# EAGLE design MegaGRRLDesktop (EAGLE 9.5.0)

## Sheet 1 of 7: Power supply
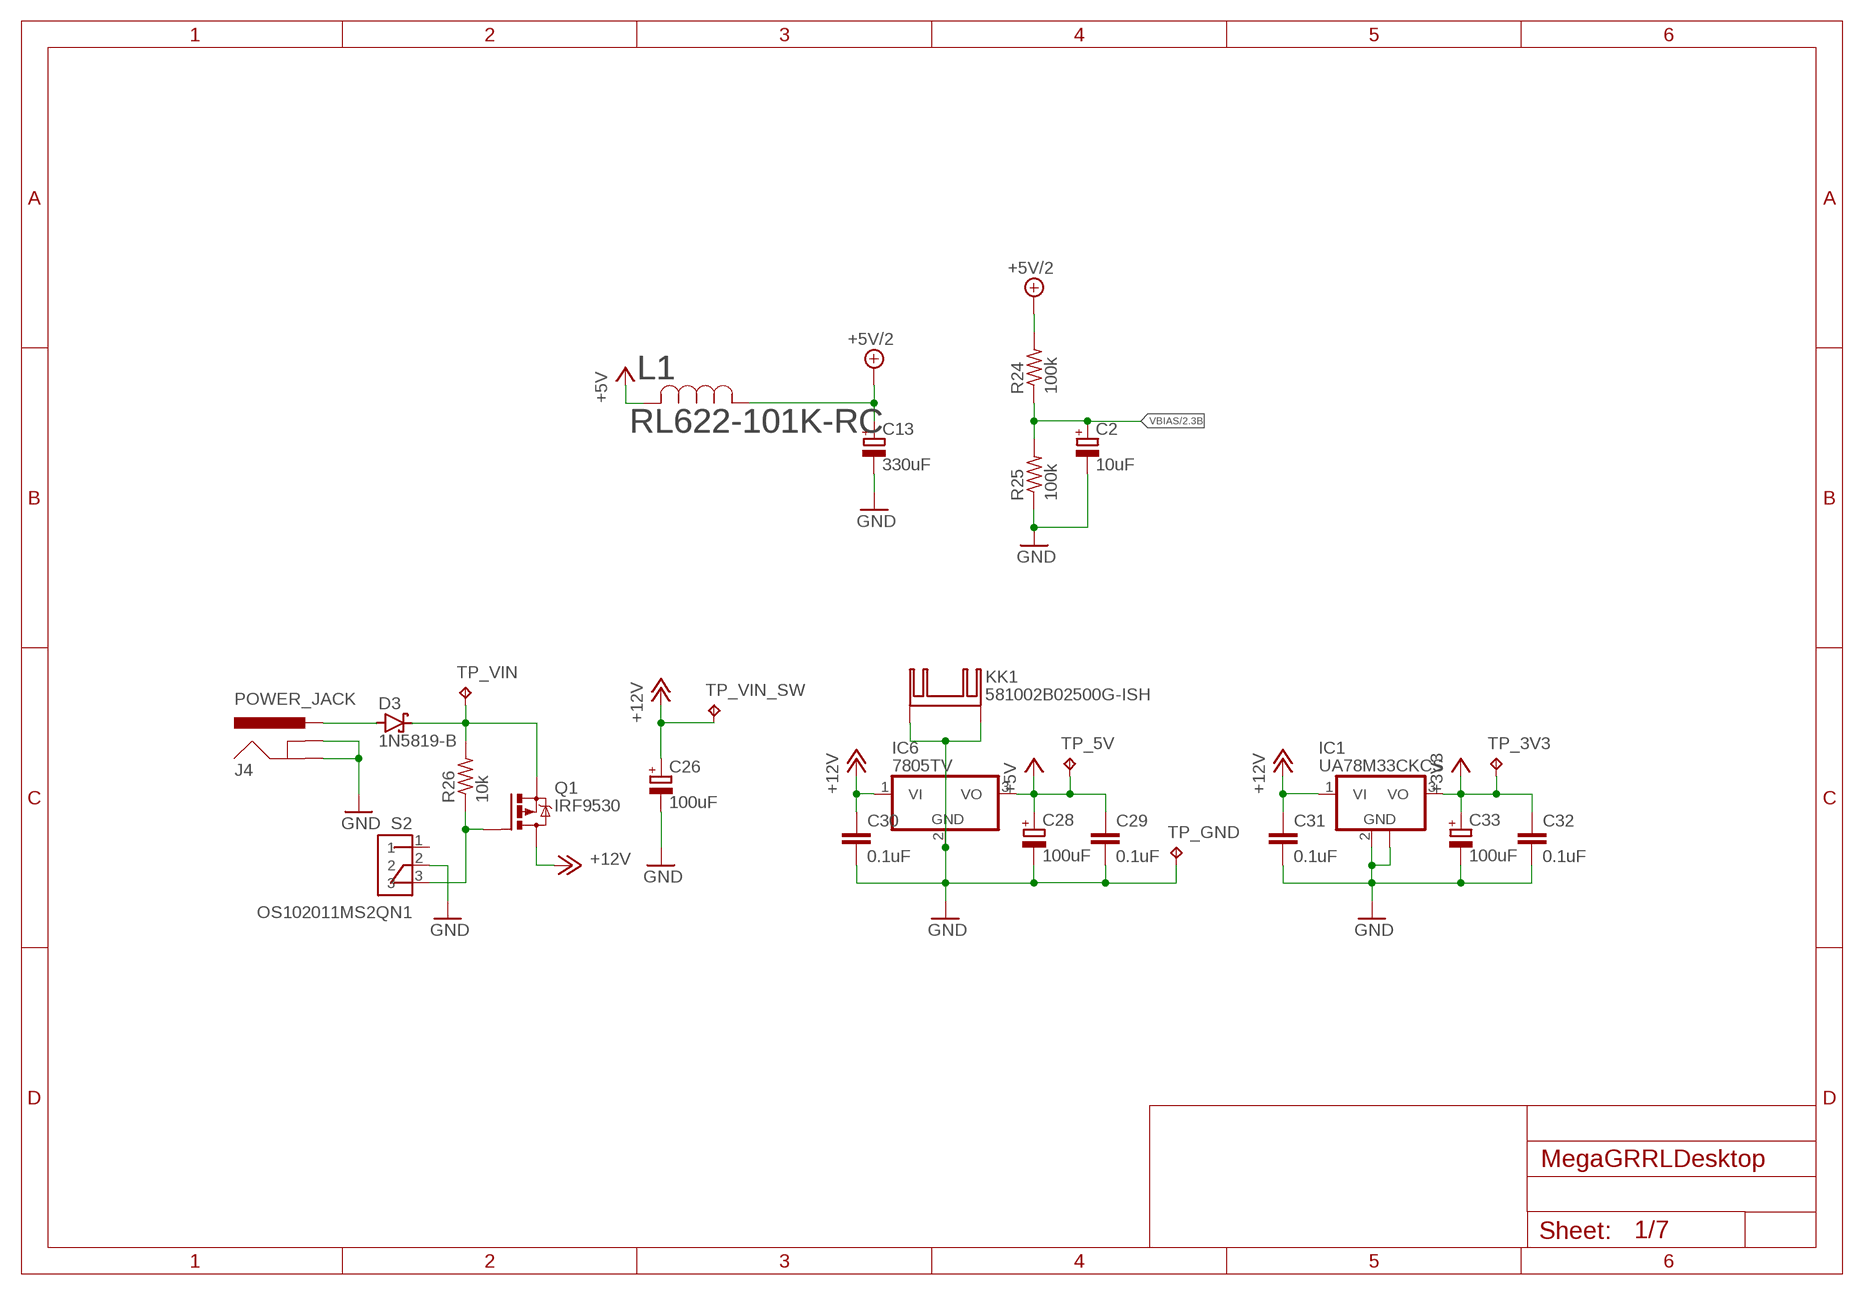
[diagram p0: schematic, sheet 1]

### Parts
C2  10uF  CPOL-EUE2.5-5  [E2,5-5]
C13  330uF  CPOL-EUE2.5-7  [E2,5-7]
C26  100uF  CPOL-EUE2.5-7  [E2,5-7]
C28  100uF  CPOL-EUE2.5-7  [E2,5-7]
C29  0.1uF  C-EU025-024X044  [C025-024X044]
C30  0.1uF  C-EU025-024X044  [C025-024X044]
C31  0.1uF  C-EU025-024X044  [C025-024X044]
C32  0.1uF  C-EU025-024X044  [C025-024X044]
C33  100uF  CPOL-EUE2.5-7  [E2,5-7]
D3  1N5819-B  [DO41-7.6]
IC1  UA78M33CKCS  UA78M33KCS  [TO220H]
IC6  7805TV  [TO220V]
J4  POWER_JACK  [POWER_JACK_PTH]
KK1  581002B02500G-ISH  [581002B02500G-ISH]
L1  RL622-101K-RC  [RL622_SERIES]
Q1  IRF9530  [TO220BV]
R24  100k  R-US_0204/7  [0204/7]
R25  100k  R-US_0204/7  [0204/7]
R26  10k  R-US_0204/7  [0204/7]
S2  OS102011MS2QN1  [SW_OS102011MS2QN1]
TP_3V3  TPB1,27  [B1,27]
TP_5V  TPB1,27  [B1,27]
TP_GND  TPB1,27  [B1,27]
TP_VIN  TPB1,27  [B1,27]
TP_VIN_SW  TPB1,27  [B1,27]

### Nets
+3V3: C32.1 C33.+ IC1.3(VO) TP_3V3.TP ; also sheet 3,4,5
+5V: C28.+ C29.1 IC6.3(VO) L1.2 TP_5V.TP ; also sheet 3,4,6
+5V/2: C13.+ L1.1 R24.2 ; also sheet 2,6
+12V: C26.+ C30.1 C31.1 IC1.1(VI) IC6.1(VI) Q1.D TP_VIN_SW.TP
GND: C2.- C13.- C26.- C28.- C29.2 C30.2 C31.2 C32.2 C33.- IC1.2(GND) IC1.TAB(GND) IC6.2(GND) J4.GND J4.GNDBREAK KK1.B1(K) KK1.B(K) R25.1 S2.2 TP_GND.TP ; also sheet 2,3,4,5,6
N$30: D3.C Q1.S R26.2 TP_VIN.TP
N$31: Q1.G R26.1 S2.3
N$32: D3.A J4.PWR
VBIAS: C2.+ R24.1 R25.2 ; also sheet 2
Unconnected: S2.1

## Sheet 2 of 7: Audio
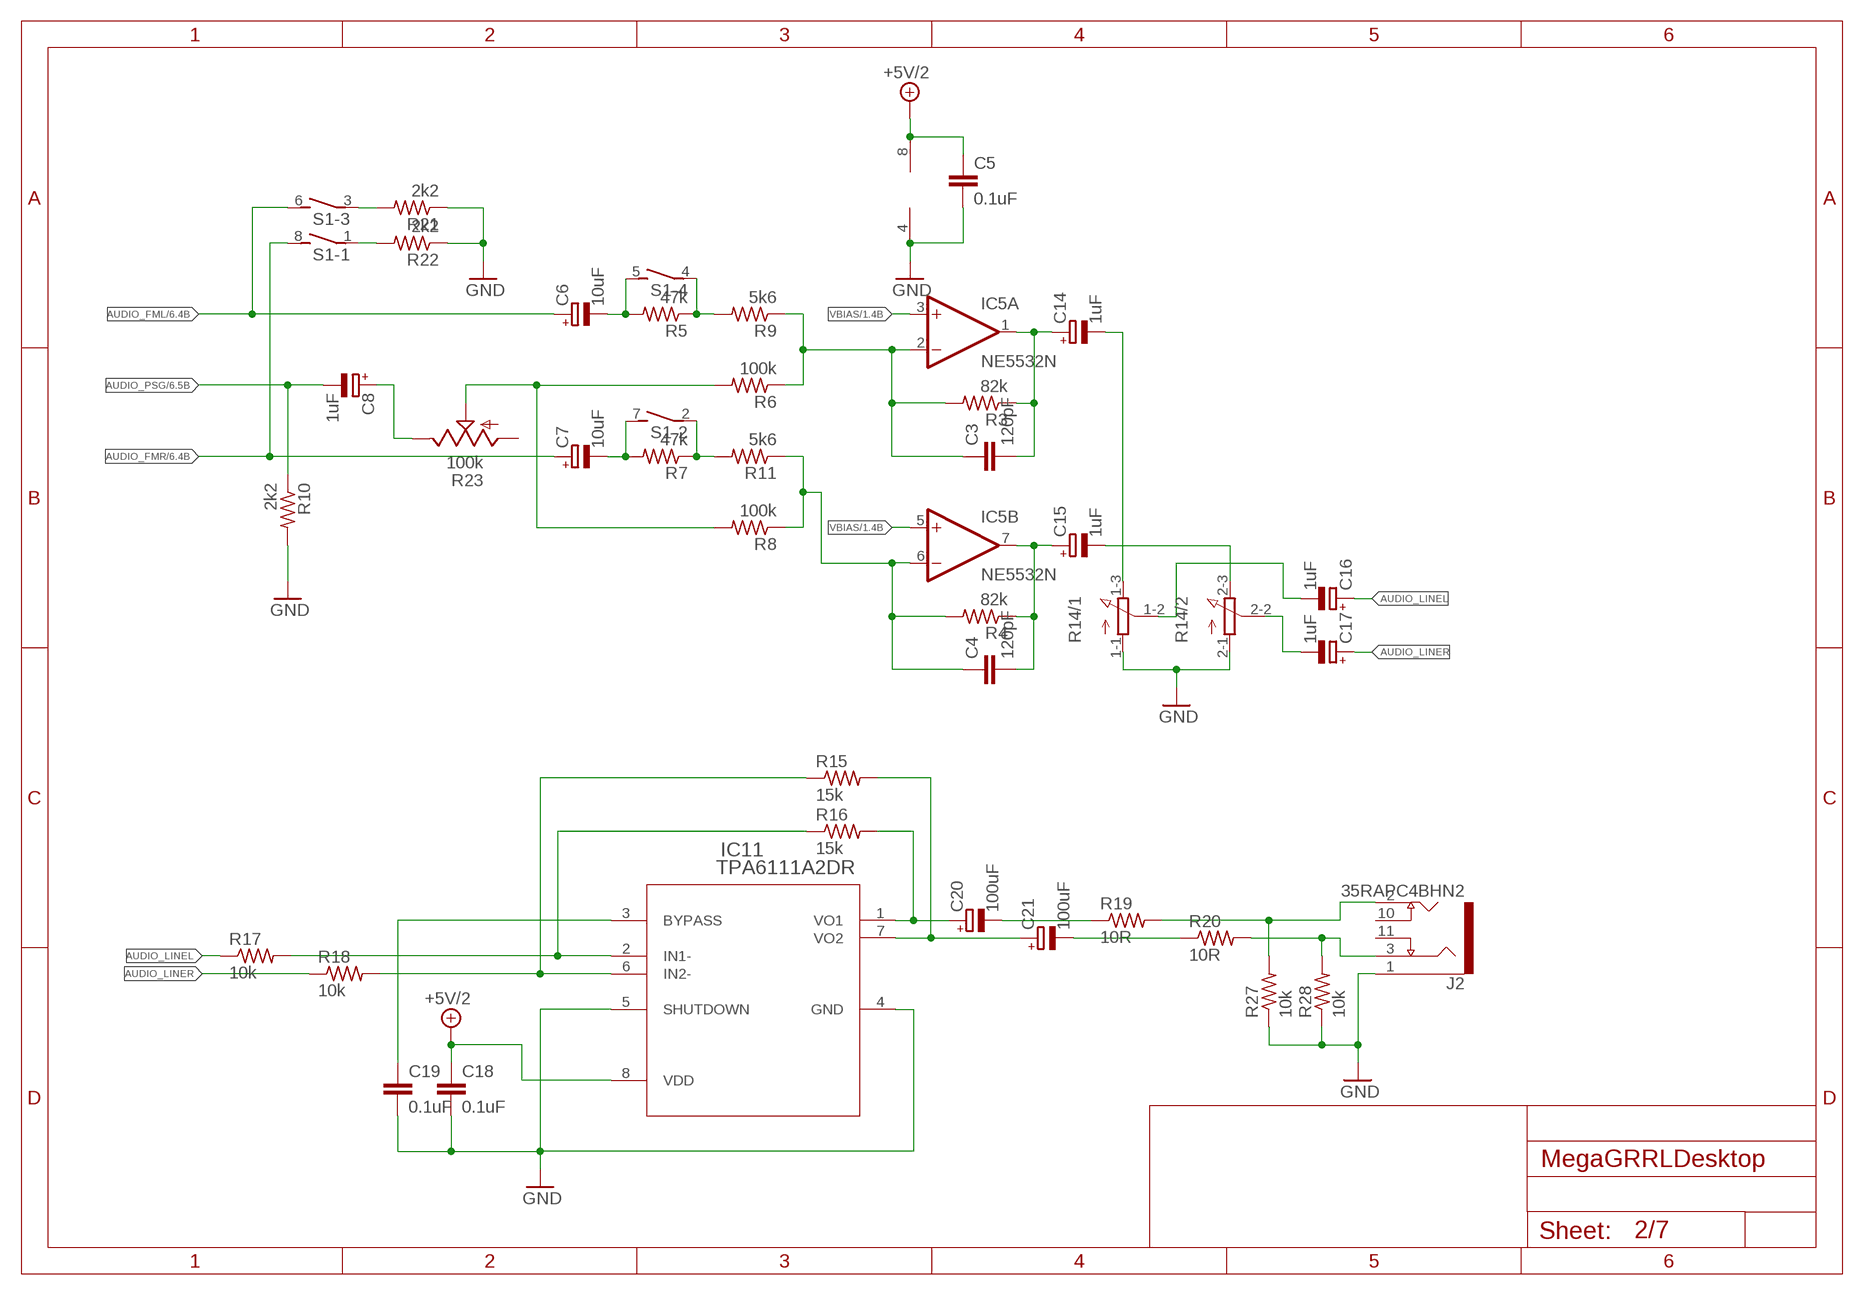
[diagram p1: schematic, sheet 2]

### Parts
C3  120pF  C-EU025-024X044  [C025-024X044]
C4  120pF  C-EU025-024X044  [C025-024X044]
C5  0.1uF  C-EU025-024X044  [C025-024X044]
C6  10uF  CPOL-EUE2.5-5  [E2,5-5]
C7  10uF  CPOL-EUE2.5-5  [E2,5-5]
C8  1uF  CPOL-EUE2-4  [E2-4]
C14  1uF  CPOL-EUE2-4  [E2-4]
C15  1uF  CPOL-EUE2-4  [E2-4]
C16  1uF  CPOL-EUE2-4  [E2-4]
C17  1uF  CPOL-EUE2-4  [E2-4]
C18  0.1uF  C-EU025-024X044  [C025-024X044]
C19  0.1uF  C-EU025-024X044  [C025-024X044]
C20  100uF  CPOL-EUE2.5-7  [E2,5-7]
C21  100uF  CPOL-EUE2.5-7  [E2,5-7]
IC5  NE5532N  [DIL08]
IC11  TPA6111A2DR  [D8]
J2  35RAPC4BHN2  [SWITCHCRAFT_35RAPC4BHN2]
R3  82k  R-US_0204/7  [0204/7]
R4  82k  R-US_0204/7  [0204/7]
R5  47k  R-US_0204/7  [0204/7]
R6  100k  R-US_0204/7  [0204/7]
R7  47k  R-US_0204/7  [0204/7]
R8  100k  R-US_0204/7  [0204/7]
R9  5k6  R-US_0204/7  [0204/7]
R10  2k2  R-US_0204/7  [0204/7]
R11  5k6  R-US_0204/7  [0204/7]
R14  3RP/1610G  [3RP/1610G]
R15  15k  R-US_0204/7  [0204/7]
R16  15k  R-US_0204/7  [0204/7]
R17  10k  R-US_0204/7  [0204/7]
R18  10k  R-US_0204/7  [0204/7]
R19  10R  R-US_0204/7  [0204/7]
R20  10R  R-US_0204/7  [0204/7]
R21  2k2  R-US_0204/7  [0204/7]
R22  2k2  R-US_0204/7  [0204/7]
R23  100k  TRIM_US-S64W  [S64W]
R27  10k  R-US_0204/7  [0204/7]
R28  10k  R-US_0204/7  [0204/7]
S1  DIP04S  [DIP04S]

### Nets
+5V/2: C5.1 C18.1 IC5.8(P:V+) IC11.8(VDD) ; also sheet 1,6
AUDIO_FML: C6.+ S1.6 ; also sheet 6
AUDIO_FMR: C7.+ S1.8 ; also sheet 6
AUDIO_LINEL: C16.+ R17.1
AUDIO_LINER: C17.+ R18.1
AUDIO_PSG: C8.- R10.1 ; also sheet 6
AUDIO_RAWL: C3.1 IC5.2(A:-IN) R3.2 R6.1 R9.1
AUDIO_RAWR: C4.1 IC5.6(B:-IN) R4.2 R8.1 R11.1
GND: C5.2 C18.2 C19.2 IC5.4(P:V-) IC11.4(GND) IC11.5(SHUTDOWN) J2.1(SLEEVE) R10.2 R14.1-1(/1:A) R14.2-1(/2:A) R21.1 R22.1 R27.1 R28.1 ; also sheet 1,3,4,5,6
N$3: R7.1 R11.2 S1.2
N$5: C3.2 C14.+ IC5.1(A:OUT) R3.1
N$7: C4.2 C15.+ IC5.7(B:OUT) R4.1
N$8: C14.- R14.1-3(/1:E)
N$9: R6.2 R8.2 R23.S
N$10: C7.- R7.2 S1.7
N$11: C6.- R5.2 S1.5
N$12: C15.- R14.2-3(/2:E)
N$13: C16.- R14.1-2(/1:S)
N$14: C17.- R14.2-2(/2:S)
N$15: IC11.2(IN1-) R16.1 R17.2
N$16: IC11.6(IN2-) R15.1 R18.2
N$17: C20.+ IC11.1(VO1) R16.2
N$18: C21.+ IC11.7(VO2) R15.2
N$19: C19.1 IC11.3(BYPASS)
N$20: J2.2(TIP) R19.2 R27.2
N$21: C20.- R19.1
N$22: C21.- R20.1
N$23: J2.3(RING) R20.2 R28.2
N$24: R5.1 R9.2 S1.4
N$25: R21.2 S1.3
N$26: R22.2 S1.1
N$27: C8.+ R23.E
VBIAS: IC5.3(A:+IN) IC5.5(B:+IN) ; also sheet 1
Unconnected: J2.10(TSH) J2.11(RSH) R23.A

## Sheet 3 of 7: MCU & interface
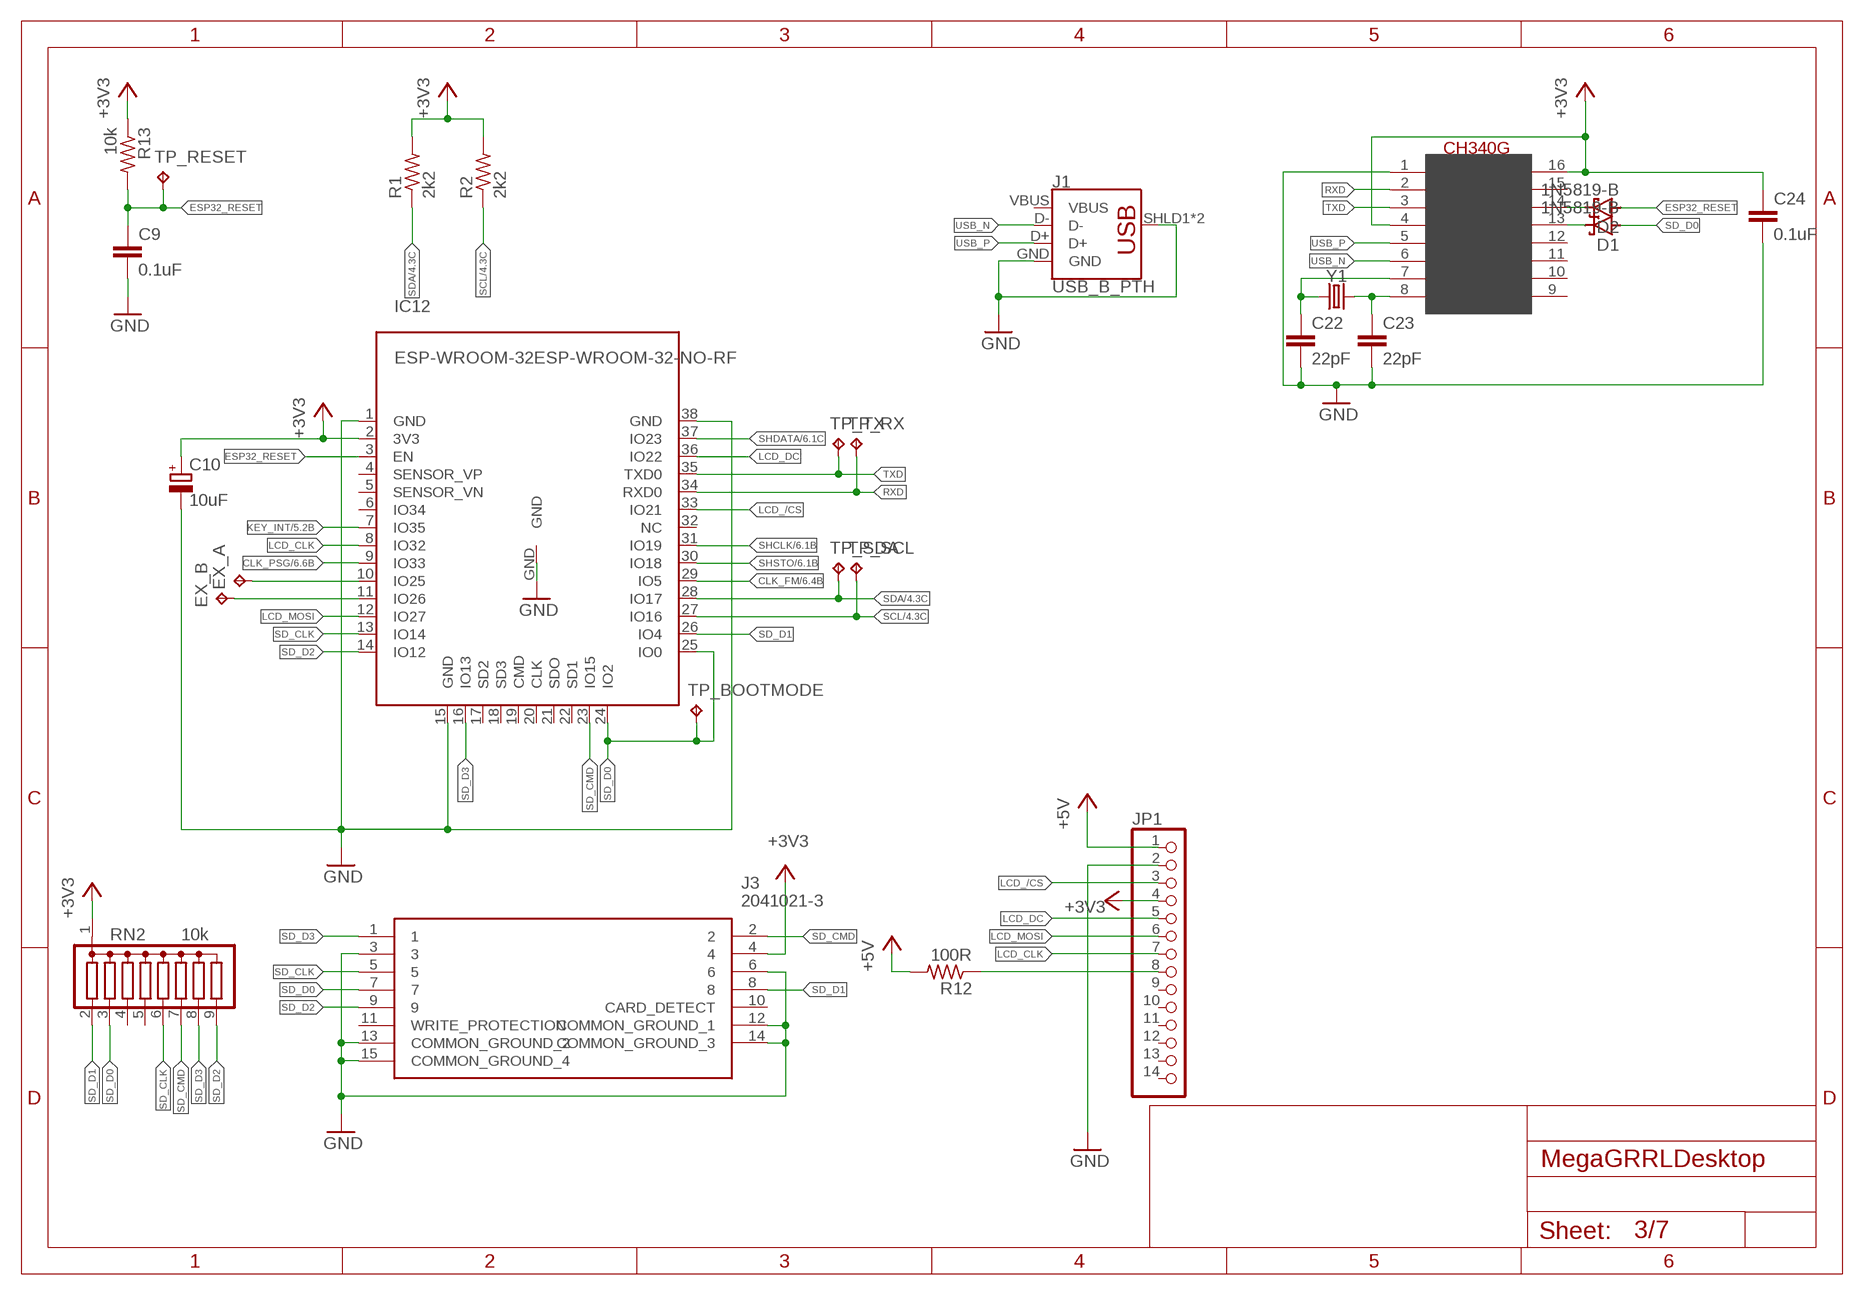
[diagram p2: schematic, sheet 3]

### Parts
C9  0.1uF  C-EU025-024X044  [C025-024X044]
C10  10uF  CPOL-EUE2.5-5  [E2,5-5]
C22  22pF  C-EU025-024X044  [C025-024X044]
C23  22pF  C-EU025-024X044  [C025-024X044]
C24  0.1uF  C-EU025-024X044  [C025-024X044]
D1  1N5819-B  [DO41-7.6]
D2  1N5819-B  [DO41-7.6]
EX_A  TPB1,27  [B1,27]
EX_B  TPB1,27  [B1,27]
IC12  ESP-WROOM-32ESP-WROOM-32-NO-RF  [ESP-WROOM-32-NO-RF]
IC14  CH340G  [SOIC16]
J1  USB_B_PTH  [USB-B-PTH]
J3  2041021-3  [2041021-3_2]
JP1  ILI9341_2_4  [ILI9341_2_4]
R1  2k2  R-US_0204/7  [0204/7]
R2  2k2  R-US_0204/7  [0204/7]
R12  100R  R-US_0204/7  [0204/7]
R13  10k  R-US_0204/7  [0204/7]
RN2  10k  G08R  [SIL9]
TP_BOOTMODE  TPB1,27  [B1,27]
TP_RESET  TPB1,27  [B1,27]
TP_RX  TPB1,27  [B1,27]
TP_SCL  TPB1,27  [B1,27]
TP_SDA  TPB1,27  [B1,27]
TP_TX  TPB1,27  [B1,27]
Y1  CRYSTALPTH-HC49US  [HC49US]

### Nets
+3V3: C10.+ C24.1 IC12.2(3V3) IC14.4(V3) IC14.16(VCC) J3.4 JP1.4 R1.2 R2.2 R13.1 RN2.1 ; also sheet 1,4,5
+5V: JP1.1 R12.2 ; also sheet 1,4,6
CLK_FM: IC12.29(IO5) ; also sheet 6
CLK_PSG: IC12.9(IO33) ; also sheet 6
ESP32_RESET: C9.1 D2.A IC12.3(EN) R13.2 TP_RESET.TP
GND: C9.2 C10.- C22.2 C23.2 C24.2 IC12.1(GND) IC12.15(GND) IC12.38(GND) IC12.GND IC14.1(GND) J1.GND J1.SHLD1(SHIELD) J1.SHLD2(SHIELD) J3.3 J3.6 J3.12(COMMON_GROUND_1) J3.13(COMMON_GROUND_2) J3.14(COMMON_GROUND_3) J3.15(COMMON_GROUND_4) JP1.2 ; also sheet 1,2,4,5,6
KEY_INT: IC12.7(IO35) ; also sheet 5
LCD_/CS: IC12.33(IO21) JP1.3
LCD_CLK: IC12.8(IO32) JP1.7
LCD_DC: IC12.36(IO22) JP1.5
LCD_MOSI: IC12.12(IO27) JP1.6
N$1: C23.1 IC14.8(XO) Y1.2
N$2: C22.1 IC14.7(XI) Y1.1
N$6: JP1.8 R12.1
N$28: D1.C IC14.13(DTR)
N$29: D2.C IC14.14(RTS)
N$33: EX_A.TP IC12.10(IO25)
N$34: EX_B.TP IC12.11(IO26)
RXD: IC12.34(RXD0) IC14.2(TX) TP_RX.TP
SCL: IC12.27(IO16) R2.1 TP_SCL.TP ; also sheet 4,5
SD_CLK: IC12.13(IO14) J3.5 RN2.6
SD_CMD: IC12.23(IO15) J3.2 RN2.7
SD_D0: D1.A IC12.24(IO2) IC12.25(IO0) J3.7 RN2.3 TP_BOOTMODE.TP
SD_D1: IC12.26(IO4) J3.8 RN2.2
SD_D2: IC12.14(IO12) J3.9 RN2.9
SD_D3: IC12.16(IO13) J3.1 RN2.8
SDA: IC12.28(IO17) R1.1 TP_SDA.TP ; also sheet 4,5
SHCLK: IC12.31(IO19) ; also sheet 6
SHDATA: IC12.37(IO23) ; also sheet 6
SHSTO: IC12.30(IO18) ; also sheet 6
TXD: IC12.35(TXD0) IC14.3(RX) TP_TX.TP
USB_N: IC14.6(D-) J1.D-
USB_P: IC14.5(D+) J1.D+
Unconnected: IC12.4(SENSOR_VP) IC12.5(SENSOR_VN) IC12.6(IO34) IC12.17(SD2) IC12.18(SD3) IC12.19(CMD) IC12.20(CLK) IC12.21(SDO) IC12.22(SD1) IC12.32(NC) IC14.9(CTS) IC14.10(DSR) IC14.11(RI) IC14.12(DCD) IC14.15(RS232) J3.10(CARD_DETECT) J3.11(WRITE_PROTECTION) JP1.9 JP1.10 JP1.11 JP1.12 JP1.13 JP1.14 RN2.4 RN2.5

## Sheet 4 of 7: LED drivers
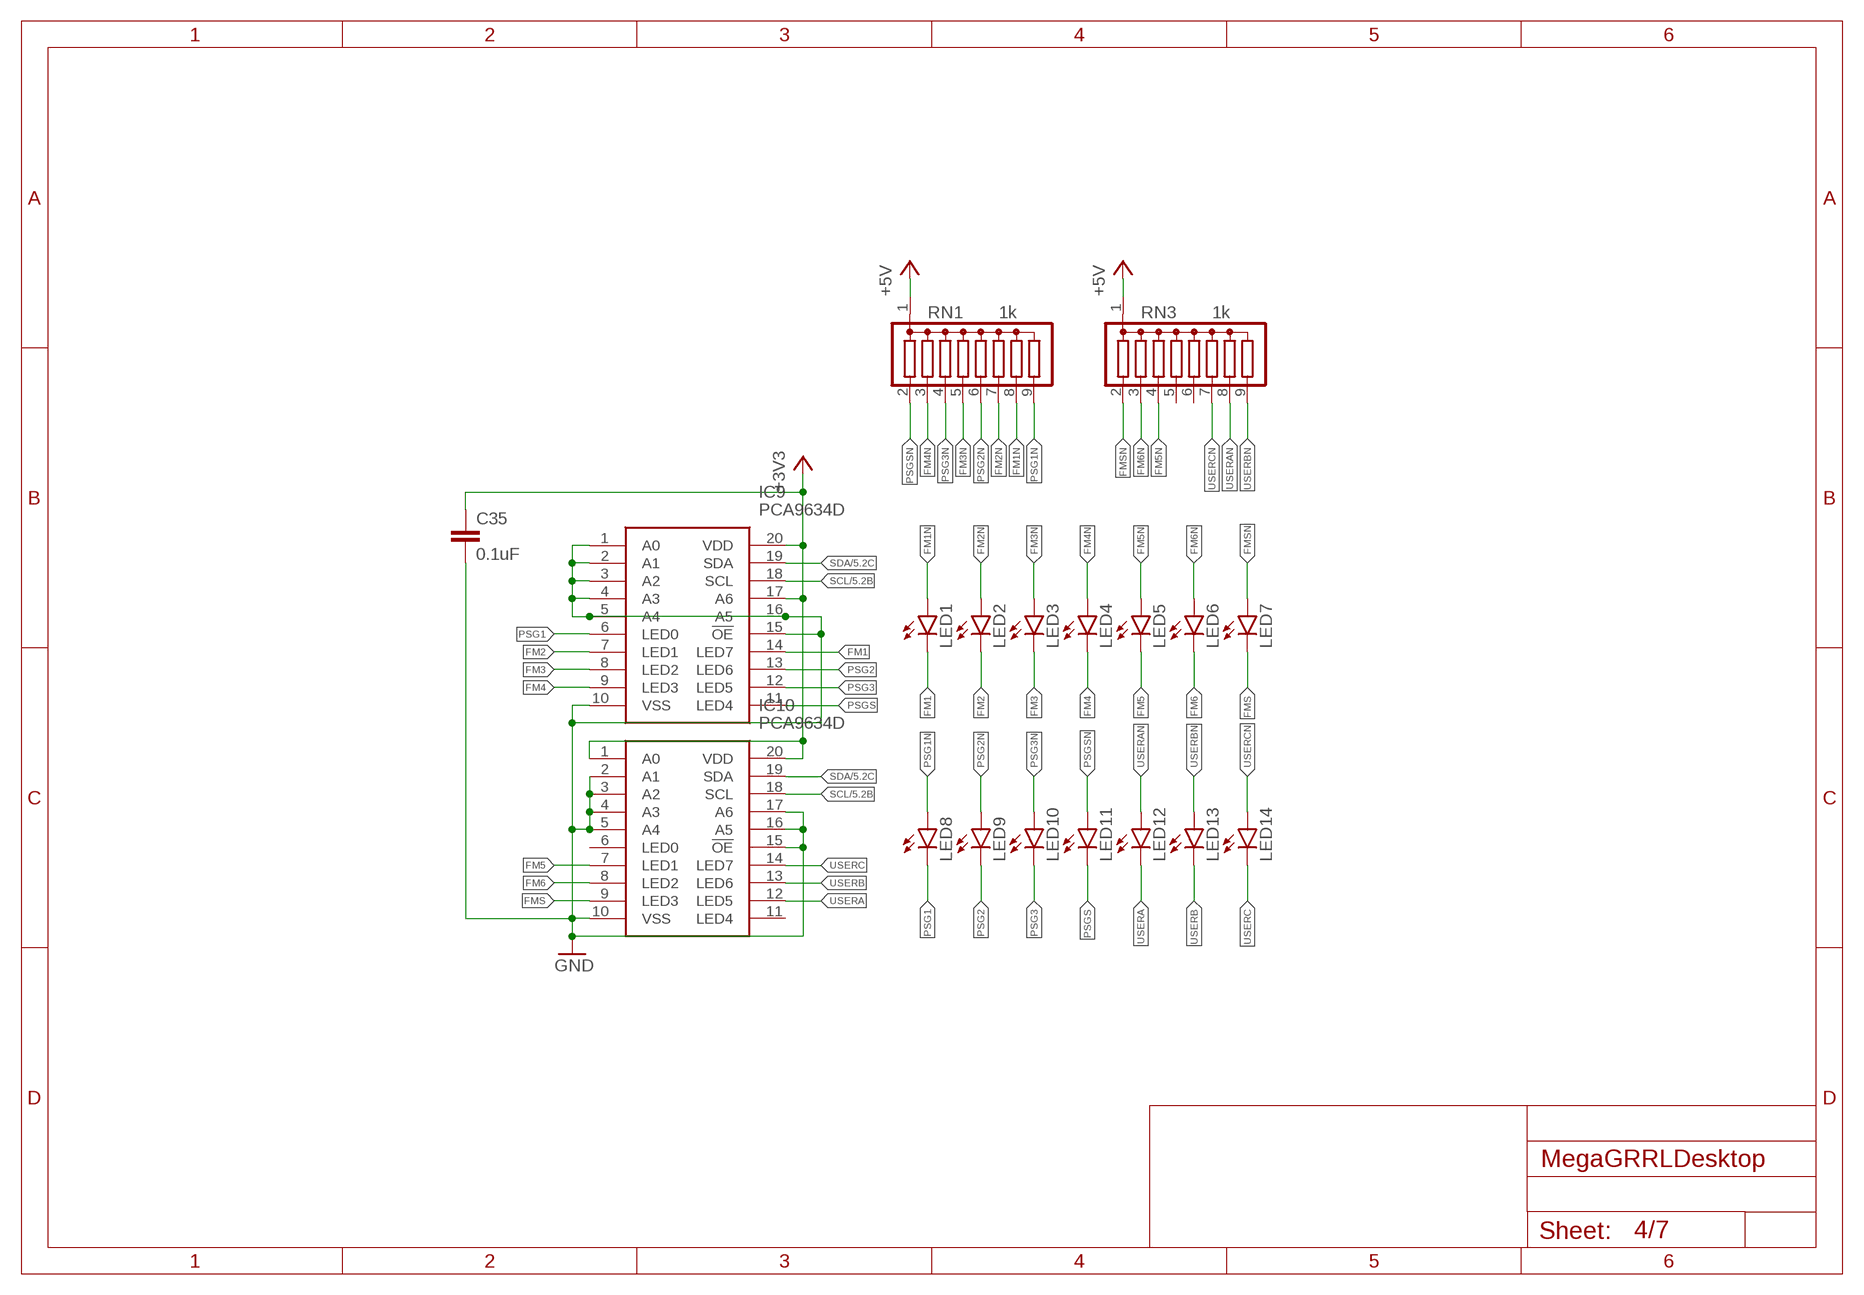
[diagram p3: schematic, sheet 4]

### Parts
C35  0.1uF  C-EU025-024X044  [C025-024X044]
IC9  PCA9634D  [SOIC127P1032X265-20N]
IC10  PCA9634D  [SOIC127P1032X265-20N]
LED1  LED3MM  [LED3MM]
LED2  LED3MM  [LED3MM]
LED3  LED3MM  [LED3MM]
LED4  LED3MM  [LED3MM]
LED5  LED3MM  [LED3MM]
LED6  LED3MM  [LED3MM]
LED7  LED3MM  [LED3MM]
LED8  LED3MM  [LED3MM]
LED9  LED3MM  [LED3MM]
LED10  LED3MM  [LED3MM]
LED11  LED3MM  [LED3MM]
LED12  LED3MM  [LED3MM]
LED13  LED3MM  [LED3MM]
LED14  LED3MM  [LED3MM]
RN1  1k  G08R  [SIL9]
RN3  1k  G08R  [SIL9]

### Nets
+3V3: C35.1 IC9.17(A6) IC9.20(VDD) IC10.1(A0) IC10.20(VDD) ; also sheet 1,3,5
+5V: RN1.1 RN3.1 ; also sheet 1,3,6
FM1: IC9.14(LED7) LED1.K(C)
FM1N: LED1.A RN1.8
FM2: IC9.7(LED1) LED2.K(C)
FM2N: LED2.A RN1.7
FM3: IC9.8(LED2) LED3.K(C)
FM3N: LED3.A RN1.5
FM4: IC9.9(LED3) LED4.K(C)
FM4N: LED4.A RN1.3
FM5: IC10.7(LED1) LED5.K(C)
FM5N: LED5.A RN3.4
FM6: IC10.8(LED2) LED6.K(C)
FM6N: LED6.A RN3.3
FMS: IC10.9(LED3) LED7.K(C)
FMSN: LED7.A RN3.2
GND: C35.2 IC9.1(A0) IC9.2(A1) IC9.3(A2) IC9.4(A3) IC9.5(A4) IC9.10(VSS) IC9.15(!OE) IC9.16(A5) IC10.2(A1) IC10.3(A2) IC10.4(A3) IC10.5(A4) IC10.10(VSS) IC10.15(!OE) IC10.16(A5) IC10.17(A6) ; also sheet 1,2,3,5,6
PSG1: IC9.6(LED0) LED8.K(C)
PSG1N: LED8.A RN1.9
PSG2: IC9.13(LED6) LED9.K(C)
PSG2N: LED9.A RN1.6
PSG3: IC9.12(LED5) LED10.K(C)
PSG3N: LED10.A RN1.4
PSGS: IC9.11(LED4) LED11.K(C)
PSGSN: LED11.A RN1.2
SCL: IC9.18(SCL) IC10.18(SCL) ; also sheet 3,5
SDA: IC9.19(SDA) IC10.19(SDA) ; also sheet 3,5
USERA: IC10.12(LED5) LED12.K(C)
USERAN: LED12.A RN3.8
USERB: IC10.13(LED6) LED13.K(C)
USERBN: LED13.A RN3.9
USERC: IC10.14(LED7) LED14.K(C)
USERCN: LED14.A RN3.7
Unconnected: IC10.6(LED0) IC10.11(LED4) RN3.5 RN3.6

## Sheet 5 of 7: Keys
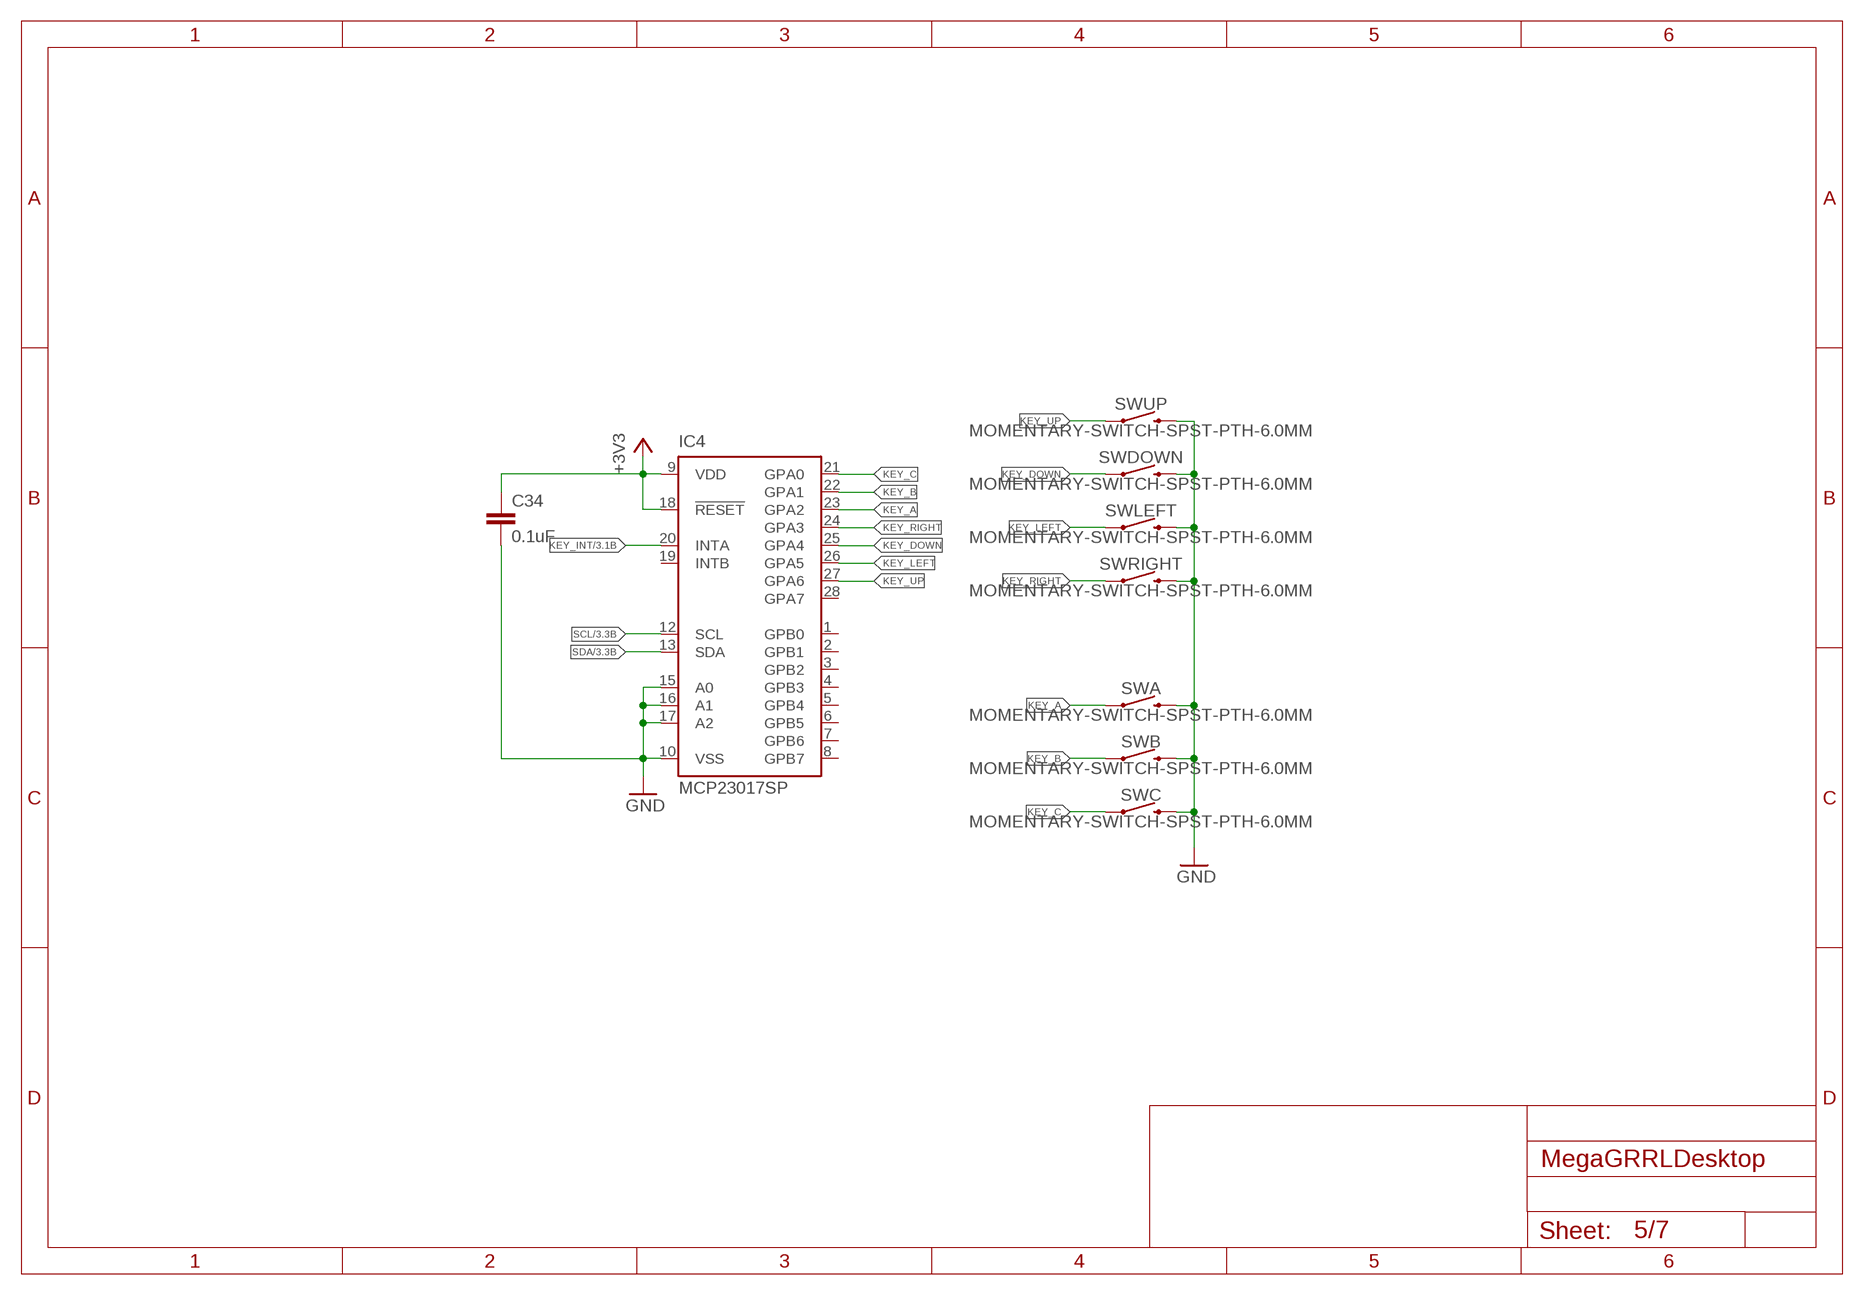
[diagram p4: schematic, sheet 5]

### Parts
C34  0.1uF  C-EU025-024X044  [C025-024X044]
IC4  MCP23017SP  [DIL28-3]
SWA  MOMENTARY-SWITCH-SPST-PTH-6.0MM  [TACTILE_SWITCH_PTH_6.0MM]
SWB  MOMENTARY-SWITCH-SPST-PTH-6.0MM  [TACTILE_SWITCH_PTH_6.0MM]
SWC  MOMENTARY-SWITCH-SPST-PTH-6.0MM  [TACTILE_SWITCH_PTH_6.0MM]
SWDOWN  MOMENTARY-SWITCH-SPST-PTH-6.0MM  [TACTILE_SWITCH_PTH_6.0MM]
SWLEFT  MOMENTARY-SWITCH-SPST-PTH-6.0MM  [TACTILE_SWITCH_PTH_6.0MM]
SWRIGHT  MOMENTARY-SWITCH-SPST-PTH-6.0MM  [TACTILE_SWITCH_PTH_6.0MM]
SWUP  MOMENTARY-SWITCH-SPST-PTH-6.0MM  [TACTILE_SWITCH_PTH_6.0MM]

### Nets
+3V3: C34.1 IC4.9(VDD) IC4.18(!RESET) ; also sheet 1,3,4
GND: C34.2 IC4.10(VSS) IC4.15(A0) IC4.16(A1) IC4.17(A2) SWA.3 SWB.3 SWC.3 SWDOWN.3 SWLEFT.3 SWRIGHT.3 SWUP.3 ; also sheet 1,2,3,4,6
KEY_A: IC4.23(GPA2) SWA.1
KEY_B: IC4.22(GPA1) SWB.1
KEY_C: IC4.21(GPA0) SWC.1
KEY_DOWN: IC4.25(GPA4) SWDOWN.1
KEY_INT: IC4.20(INTA) ; also sheet 3
KEY_LEFT: IC4.26(GPA5) SWLEFT.1
KEY_RIGHT: IC4.24(GPA3) SWRIGHT.1
KEY_UP: IC4.27(GPA6) SWUP.1
SCL: IC4.12(SCL) ; also sheet 3,4
SDA: IC4.13(SDA) ; also sheet 3,4
Unconnected: IC4.1(GPB0) IC4.2(GPB1) IC4.3(GPB2) IC4.4(GPB3) IC4.5(GPB4) IC4.6(GPB5) IC4.7(GPB6) IC4.8(GPB7) IC4.19(INTB) IC4.28(GPA7)

## Sheet 6 of 7: Sound chips & bus
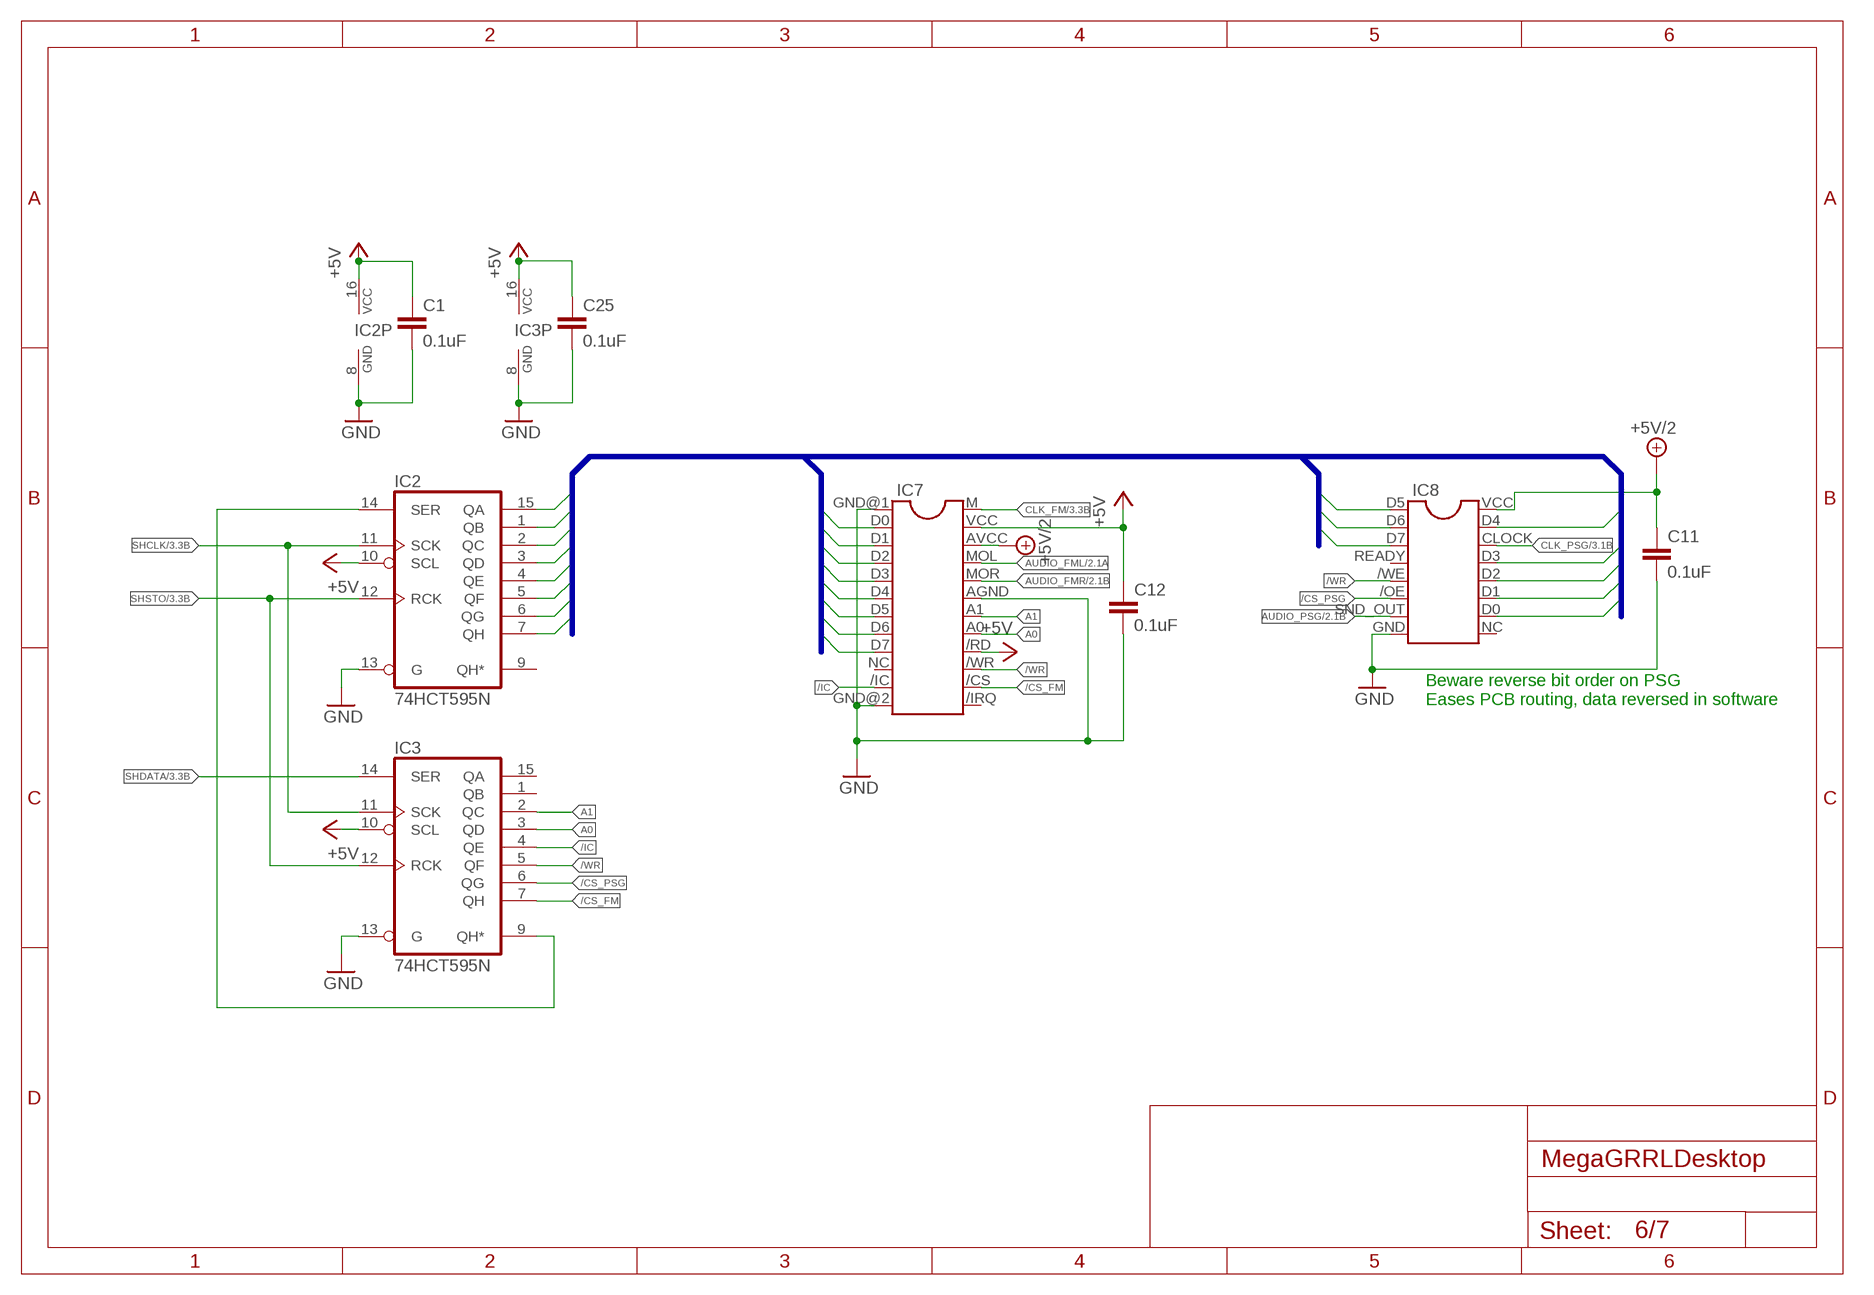
[diagram p5: schematic, sheet 6]

### Parts
C1  0.1uF  C-EU025-024X044  [C025-024X044]
C11  0.1uF  C-EU025-024X044  [C025-024X044]
C12  0.1uF  C-EU025-024X044  [C025-024X044]
C25  0.1uF  C-EU025-024X044  [C025-024X044]
IC2  74HCT595N  [DIL16]
IC3  74HCT595N  [DIL16]
IC7  YM2612  [YM2612]
IC8  SN76489  [SN76489]

### Nets
+5V: C1.1 C12.1 C25.1 IC2.10(SCL) IC2.16(VCC) IC3.10(SCL) IC3.16(VCC) IC7./RD IC7.VCC ; also sheet 1,3,4
+5V/2: C11.1 IC7.AVCC IC8.VCC ; also sheet 1,2
/CS_FM: IC3.7(QH) IC7./CS
/CS_PSG: IC3.6(QG) IC8./OE
/IC: IC3.4(QE) IC7./IC
/WR: IC3.5(QF) IC7./WR IC8./WE
A0: IC3.3(QD) IC7.A0
A1: IC3.2(QC) IC7.A1
AUDIO_FML: IC7.MOL ; also sheet 2
AUDIO_FMR: IC7.MOR ; also sheet 2
AUDIO_PSG: IC8.SND_OUT ; also sheet 2
CLK_FM: IC7.M ; also sheet 3
CLK_PSG: IC8.CLOCK ; also sheet 3
D0: IC2.15(QA) IC7.D0 IC8.D7
D1: IC2.1(QB) IC7.D1 IC8.D6
D2: IC2.2(QC) IC7.D2 IC8.D5
D3: IC2.3(QD) IC7.D3 IC8.D4
D4: IC2.4(QE) IC7.D4 IC8.D3
D5: IC2.5(QF) IC7.D5 IC8.D2
D6: IC2.6(QG) IC7.D6 IC8.D1
D7: IC2.7(QH) IC7.D7 IC8.D0
GND: C1.2 C11.2 C12.2 C25.2 IC2.8(GND) IC2.13(G) IC3.8(GND) IC3.13(G) IC7.AGND IC7.GND@1(GND) IC7.GND@2(GND) IC8.GND ; also sheet 1,2,3,4,5
N$4: IC2.14(SER) IC3.9(QH*)
SHCLK: IC2.11(SCK) IC3.11(SCK) ; also sheet 3
SHDATA: IC3.14(SER) ; also sheet 3
SHSTO: IC2.12(RCK) IC3.12(RCK) ; also sheet 3
Unconnected: IC2.9(QH*) IC3.1(QB) IC3.15(QA) IC7./IRQ IC7.NC IC8.NC IC8.READY

### Buses
D[0..7]

### Notes on the sheet
- Beware reverse bit order on PSG
  Eases PCB routing, data reversed in software

## Sheet 7 of 7: Misc
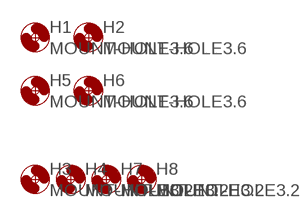
[diagram p6: schematic, sheet 7]

### Parts
H1  MOUNT-HOLE3.6  [3,6]
H2  MOUNT-HOLE3.6  [3,6]
H3  MOUNT-HOLE3.2  [3,2]
H4  MOUNT-HOLE3.2  [3,2]
H5  MOUNT-HOLE3.6  [3,6]
H6  MOUNT-HOLE3.6  [3,6]
H7  MOUNT-HOLE3.2  [3,2]
H8  MOUNT-HOLE3.2  [3,2]

## Power pins joined to a net without a drawn wire
VBUS: J1.VBUS

## Library data of the parts
C1 C3-C5 C9 C11 C12 C18 C19 C22-C25 C29-C32 C34 C35 = rcl:C-EU: CAPACITOR, European symbol; SPICEPREFIX: C
C2 C6-C8 C10 C13-C17 C20 C21 C26 C28 C33 = rcl:CPOL-EU: POLARIZED CAPACITOR, European symbol; SPICEPREFIX: C
D1-D3 = diode:1N581*: 1.0A SCHOTTKY BARRIER RECTIFIER Source: http://www.diodes.com/datasheets/ds23001.pdf
EX_A EX_B TP_3V3 TP_5V TP_BOOTMODE TP_GND TP_RESET TP_RX TP_SCL TP_SDA TP_TX TP_VIN TP_VIN_SW = testpad:TP: Test pad; SPICEPREFIX: X
H1-H8 = holes:MOUNT-HOLE: MOUNTING HOLE with drill center marker
IC1 = to220h-plated:UA78M*: POSITIVE-VOLTAGE REGULATORS Source: http://focus.ti.com/lit/ds/symlink/ua78m33.pdf
IC2 IC3 = 74xx-eu:74*595: 8-bit SHIFT REGISTER, output latch
IC4 = microchip:MCP23017: http://ww1.microchip.com/downloads/en/DeviceDoc/21952a.pdf Source: http://ww1.microchip.com/downloads/en/DeviceDoc/21952a.pdf; MF: MICROCHIP; MPN: MCP23017-E/SP; OC_FARNELL: 1332088; OC_NEWARK: 31K2959
IC5 = linear:NE5532: AUDIO AMPLIFIER
IC6 = linear:78*: Positive VOLTAGE REGULATOR Source: http://cache.national.com/ds/LM/LM78L05.pdf http://www.fairchildsemi.com/ds/LM/LM7805.pdf
IC7 = yammy-ha:YM2612: Dual In Line
IC8 = retrosound:SN76489: Dual In Line / Socket
IC9 IC10 = PCA9634D:PCA9634D: 8-bit Fm+ I2C-bus LED driver Source: Datasheet <http://www.nxp.com/documents/data_sheet/PCA9634.pdf>; DESCRIPTION: 8-bit Fm+ I2C-bus LED driver; HEIGHT: 2.65mm; MANUFACTURER_NAME: Nexperia; MANUFACTURER_PART_NUMBER: PCA9634D; MOUSER_PART_NUMBER: N/A; MOUSER_PRICE-STOCK: https://www.mouser.com/Search/Refine.aspx?Keyword=N%2FA
IC11 = UL:TPA6111A2DR; MANUFACTURER_PART_NUMBER: TPA6111A2DR; VENDOR: Texas Instruments
IC12 = esp32:ESP-WROOM-32
IC14 = usb-serial-modified:CH340G
J1 = SparkFun-Connectors:USB_B: USB Type B Connector SparkFun Products: SparkFun Stepoko <https://www.sparkfun.com/products/13899> PTH; PROD_ID: CONN-08278; SF_ID: PRT-00139
J2 = 35RAPC4BHN2:35RAPC4BHN2: Conn 3.5MM Stereo Jack F 5 POS Solder RA Thru-Hole 5 Terminal 1 Port; DESCRIPTION: Conn 3.5MM Stereo Jack F 5 POS Solder RA Thru-Hole 5 Terminal 1 Port; DIGI-KEY_PART_NUMBER: SC1459-ND; DIGI-KEY_PURCHASE_URL: https://www.digikey.com/product-detail/en/switchcraft-inc/35RAPC4BHN2/SC1459-ND/1288690?WT.z_cid=ref_snapeda&utm_source=snapeda&utm_medium=aggregator&utm_campaign=buynow; MF: Switchcraft; MP: 35RAPC4BHN2; PACKAGE: None
J3 = 2041021-3:2041021-3: SD card connector, SMT, push-pull SD card connector, SMT, push-pull Source: Datasheet <https://componentsearchengine.com/Datasheets/1/2041021-3.pdf>; DESCRIPTION: SD card connector, SMT, push-pull SD card connector, SMT, push-pull; HEIGHT: mm; MANUFACTURER_NAME: TE Connectivity; MANUFACTURER_PART_NUMBER: 2041021-3; MOUSER_PART_NUMBER: 571-2041021-3; MOUSER_PRICE-STOCK: https://www.mouser.com/Search/Refine.aspx?Keyword=571-2041021-3
J4 = SparkFun-Connectors:POWER_JACK: Power Jack Connector This is the standard 5.5mm barrel jack for power. The PTH is the most common, proven, reliable, footprint. The Slot footprint only works if the mill layer is transmitted to the PCB fab house so be warned. Here are the connectors we sell at SparkFun: DC Barrel Power Jack/Connector <https://www.sparkfun.com/products/119> (PRT-00119) DC Barrel Power Jack/Connector (SMD) <https://www.sparkfun.com/products/12748> (PRT-12748) DC Barrel Jack Adapter - Breadboard Compatible <https://www.sparkfun.com/products/10811> (PRT-10811) It is used on this SparkFun product (and many, many others): SparkFun RedBoard - Programmed with Arduino <https://www.sparkfun.com/products/12757> (DEV-12757) Also, if you need a mating power supply or connector, please check these out: Wall Adapter Power Supply - 9VDC 650mA <https://www.sparkfun.com/products/298> (TOL-00298) DC Barrel Jack Adapter - Male <https://www.sparkfun.com/products/10287> (PRT-10287); PROD_ID: CONN-08197
JP1 = ili9341_2_4in:ILI9341_2_4: PIN HEADER
KK1 = natalieheatsink:581002B02500G-ISH: HEATSINK distributor Schukat
L1 = UL:RL622-101K-RC; MANUFACTURER_PART_NUMBER: RL622101KRC; VENDOR: Bourns Electronics
LED1-LED14 = led:LED: LED OSRAM: - CHIPLED LG R971, LG N971, LY N971, LG Q971, LY Q971, LO R971, LY R971 LH N974, LH R974 LS Q976, LO Q976, LY Q976 LO Q996 - Hyper CHIPLED LW Q18S LB Q993, LB Q99A, LB R99A - SideLED LS A670, LO A670, LY A670, LG A670, LP A670 LB A673, LV A673, LT A673, LW A673 LH A674 LY A675 LS A676, LA A676, LO A676, LY A676, LW A676 LS A679, LY A679, LG A679 - Hyper Micro SIDELED® LS Y876, LA Y876, LO Y876, LY Y876 LT Y87S - SmartLED LW L88C, LW L88S LB L89C, LB L89S, LG L890 LS L89K, LO L89K, LY L89K LS L896, LA L896, LO L896, LY L896 - TOPLED LS T670, LO T670, LY T670, LG T670, LP T670 LSG T670, LSP T670, LSY T670, LOP T670, LYG T670 LG T671, LOG T671, LSG T671 LB T673, LV T673, LT T673, LW T673 LH T674 LS T676, LA T676, LO T676, LY T676, LB T676, LH T676, LSB T676, LW T676 LB T67C, LV T67C, LT T67C, LS T67K, LO T67K, LY T67K, LW E67C LS E67B, LA E67B, LO E67B, LY E67B, LB E67C, LV E67C, LT E67C LW T67C LS T679, LY T679, LG T679 LS T770, LO T770, LY T770, LG T770, LP T770 LB T773, LV T773, LT T773, LW T773 LH T774 LS E675, LA E675, LY E675, LS T675 LS T776, LA T776, LO T776, LY T776, LB T776 LHGB T686 LT T68C, LB T68C - Hyper Mini TOPLED® LB M676 - Mini TOPLED Santana® LG M470 LS M47K, LO M47K, LY M47K Source: http://www.osram.convergy.de LUXEON: - LUMILED® LXK2-PW12-R00, LXK2-PW12-S00, LXK2-PW14-U00, LXK2-PW14-V00 LXK2-PM12-R00, LXK2-PM12-S00, LXK2-PM14-U00 LXK2-PE12-Q00, LXK2-PE12-R00, LXK2-PE12-S00, LXK2-PE14-T00, LXK2-PE14-U00 LXK2-PB12-K00, LXK2-PB12-L00, LXK2-PB12-M00, LXK2-PB14-N00, LXK2-PB14-P00, LXK2-PB14-Q00 LXK2-PR12-L00, LXK2-PR12-M00, LXK2-PR14-Q00, LXK2-PR14-R00 LXK2-PD12-Q00, LXK2-PD12-R00, LXK2-PD12-S00 LXK2-PH12-R00, LXK2-PH12-S00 LXK2-PL12-P00, LXK2-PL12-Q00, LXK2-PL12-R00 Source: www.luxeon.com KINGBRIGHT: KA-3528ASYC Source: www.kingbright.com
Q1 = transistor-power:IRF9530: P-CHANNEL HEXFET POWER-MOS-FET Source: http://www.irf.com/product-info/datasheets/data/irf9530.pdf
R1-R13 R15-R22 R24-R28 = rcl:R-US_: RESISTOR, American symbol; SPICEPREFIX: R
R14 = pot:3RP/1610G: 16mm Potentiometer two level Source: http://www.alphapotentiometers.net/html/16mm_pot_2.html
R23 = pot:TRIM_US-: POTENTIOMETER
RN1-RN3 = resistor-sil:G08R: SIL RESISTOR; OC_FARNELL: unknown; OC_NEWARK: unknown
S1 = switch-dil:DIP04S: DIL/CODE SWITCH; OC_FARNELL: unknown; OC_NEWARK: unknown
S2 = OS102011MS2QN1:OS102011MS2QN1: Switch Slide ON ON SPDT Top Slide 0.1A 12VDC 10000Cycles PC Pins Thru-Hole Bulk; DESCRIPTION: Switch Slide ON ON SPDT Top Slide 0.1A 12VDC 10000Cycles PC Pins Thru-Hole Bulk; DIGI-KEY_PART_NUMBER: CKN9565-ND; DIGI-KEY_PURCHASE_URL: https://www.digikey.com/product-detail/en/c-k/OS102011MS2QN1/CKN9565-ND/411602?utm_source=snapeda&utm_medium=aggregator&utm_campaign=symbol; MF: C&K; MP: OS102011MS2QN1; PACKAGE: DO-201 C&amp;K Components
SWA SWB SWC SWDOWN SWLEFT SWRIGHT SWUP = SparkFun-Switches:MOMENTARY-SWITCH-SPST: Momentary Switch (Pushbutton) - SPST Normally-open (NO) SPST momentary switches (buttons, pushbuttons). Variants PTH-12MM - 12mm square, through-hole Momentary Pushbutton Switch - 12mm Square <https://www.sparkfun.com/products/9190> (COM-09190) PTH-6.0MM, PTH-6.0MM-KIT - 6.0mm square, through-hole Mini Pushbutton Switch <https://www.sparkfun.com/products/97> (COM-00097) KIT package intended for soldering kit's - only one side of pads' copper is exposed. PTH-RIGHT-ANGLE-KIT - Right-angle, through-hole Right Angle Tactile Button <https://www.sparkfun.com/products/10791> - Used on SparkFun BigTime Watch Kit <https://www.sparkfun.com/products/11734> SMD-12MM - 12mm square, surface-mount Tactile Button - SMD (12mm) <https://www.sparkfun.com/products/12993> (COM-12993) Used on SparkFun PicoBoard <https://www.sparkfun.com/products/11888> SMD-4.5MM - 4.5mm Square Trackball Switch Used on SparkFun Blackberry Trackballer Breakout <https://www.sparkfun.com/products/13169> SMD-4.6MMX2.8MM - 4.60mm x 2.80mm, surface mount Used on SparkFun SAMD21 Mini Breakout <https://www.sparkfun.com/products/13664> SMD-5.2MM, SMD-5.2-REDUNDANT - 5.2mm square, surface-mount Mini Pushbutton Switch - SMD <https://www.sparkfun.com/products/8720> (COM-08720) Used on Arduino Pro Mini <https://www.sparkfun.com/products/11114> REDUNDANT package connects both switch circuits together SMD-6.0X3.5MM - 6.0 x 3.5mm, surface mount Momentary Reset Switch SMD <https://www.sparkfun.com/products/8229> (COM-08229) SMD-6.2MM-TALL - 6.2mm square, surface mount Tactile Button - SMD (6mm) <https://www.sparkfun.com/products/12992> Used on SparkFun Digital Sandbox <https://www.sparkfun.com/products/12651> SMD-RIGHT-ANGLE - Right-angle, surface mount Used on SparkFun Block for Intel® Edison - Arduino <https://www.sparkfun.com/products/13036>; PROD_ID: SWCH-08441; SF_SKU: COM-00097
Y1 = SparkFun-Clocks:CRYSTAL: Crystals (Generic) These are passive quartz crystals, which can be used as a clock source for a microcontroller. Crystal's are two-terminal devices. They require external "load" capacitors to generate an oscillating signal.

## Board
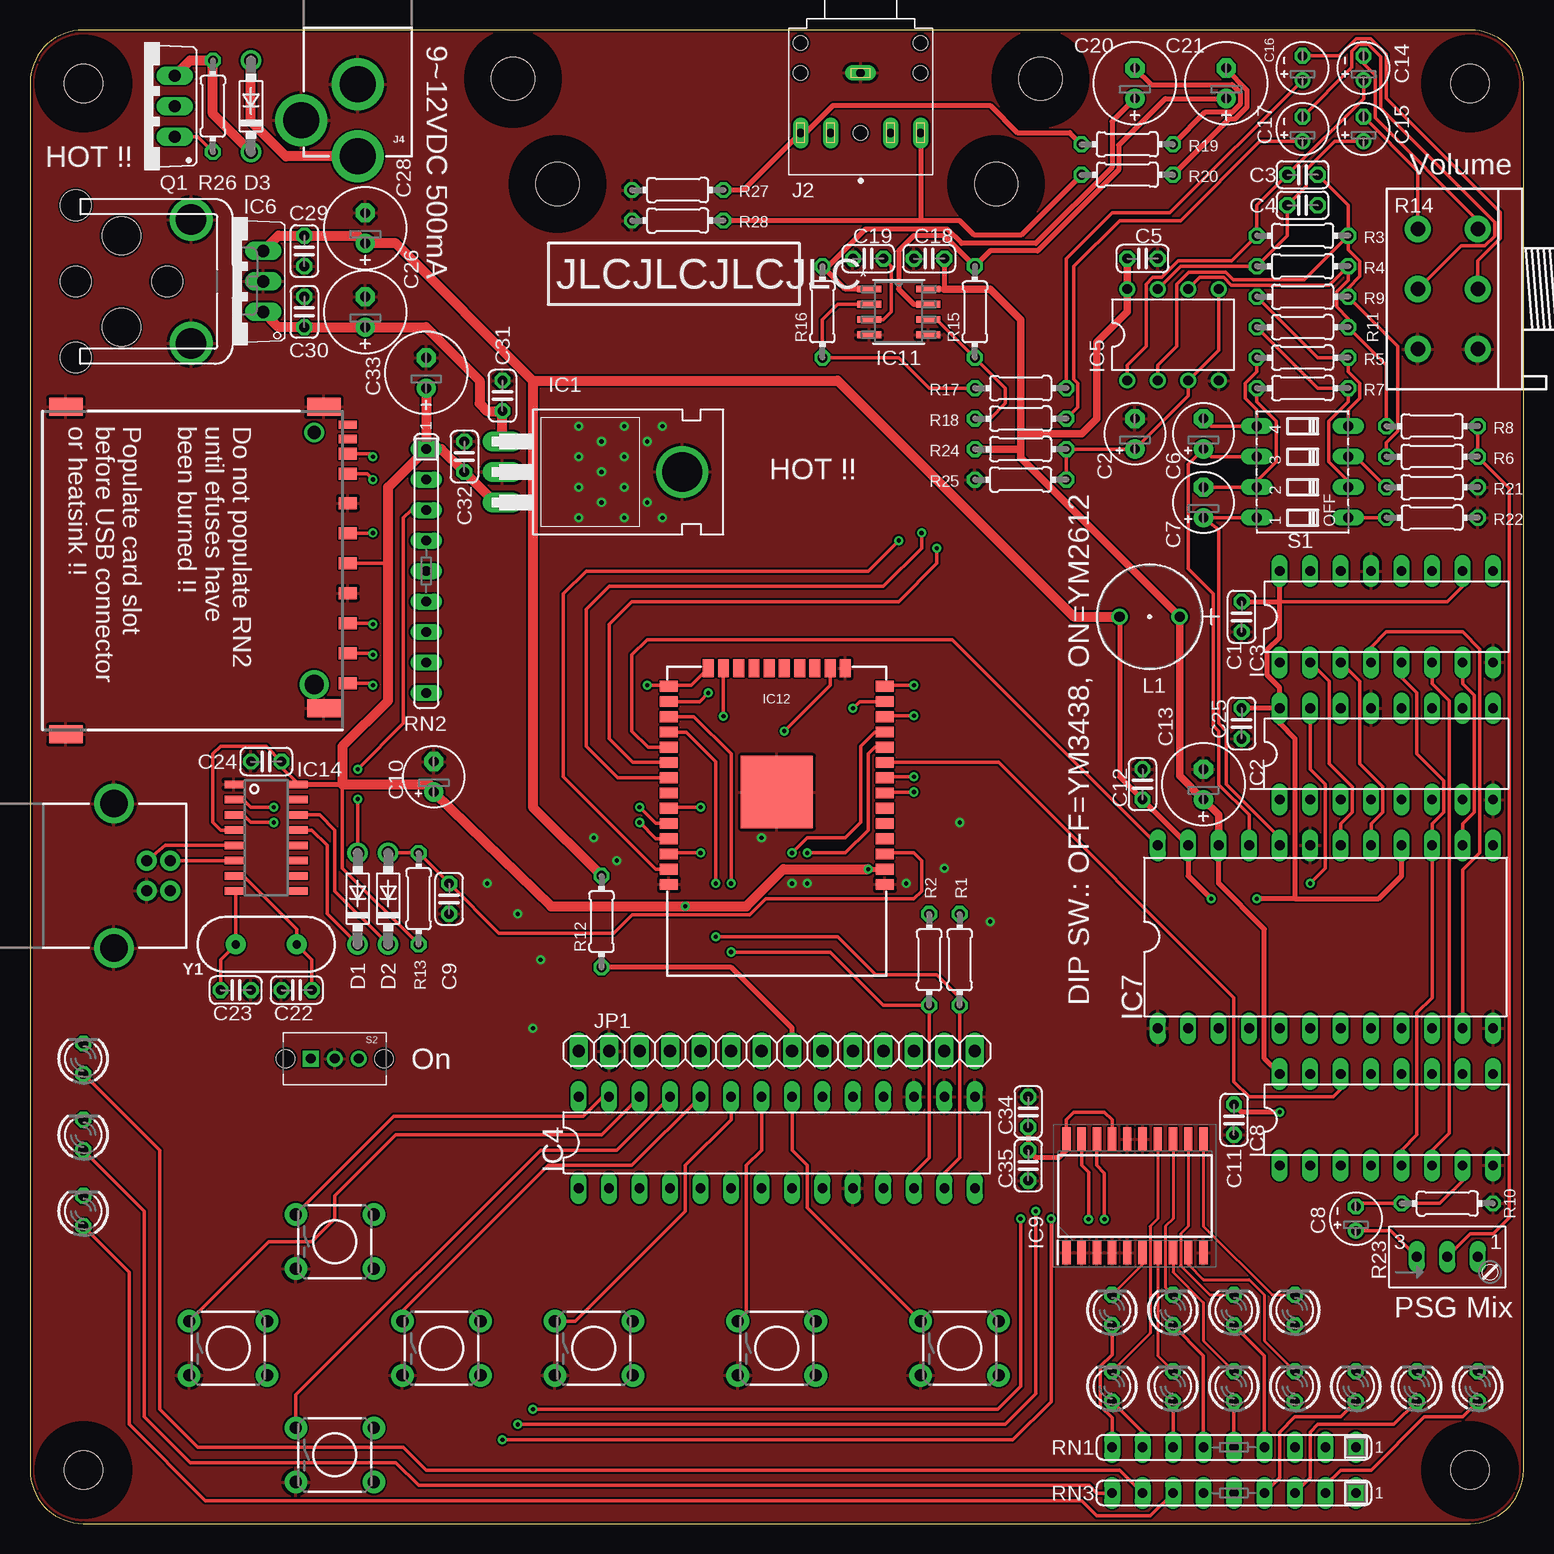
[diagram p7: board, top side]
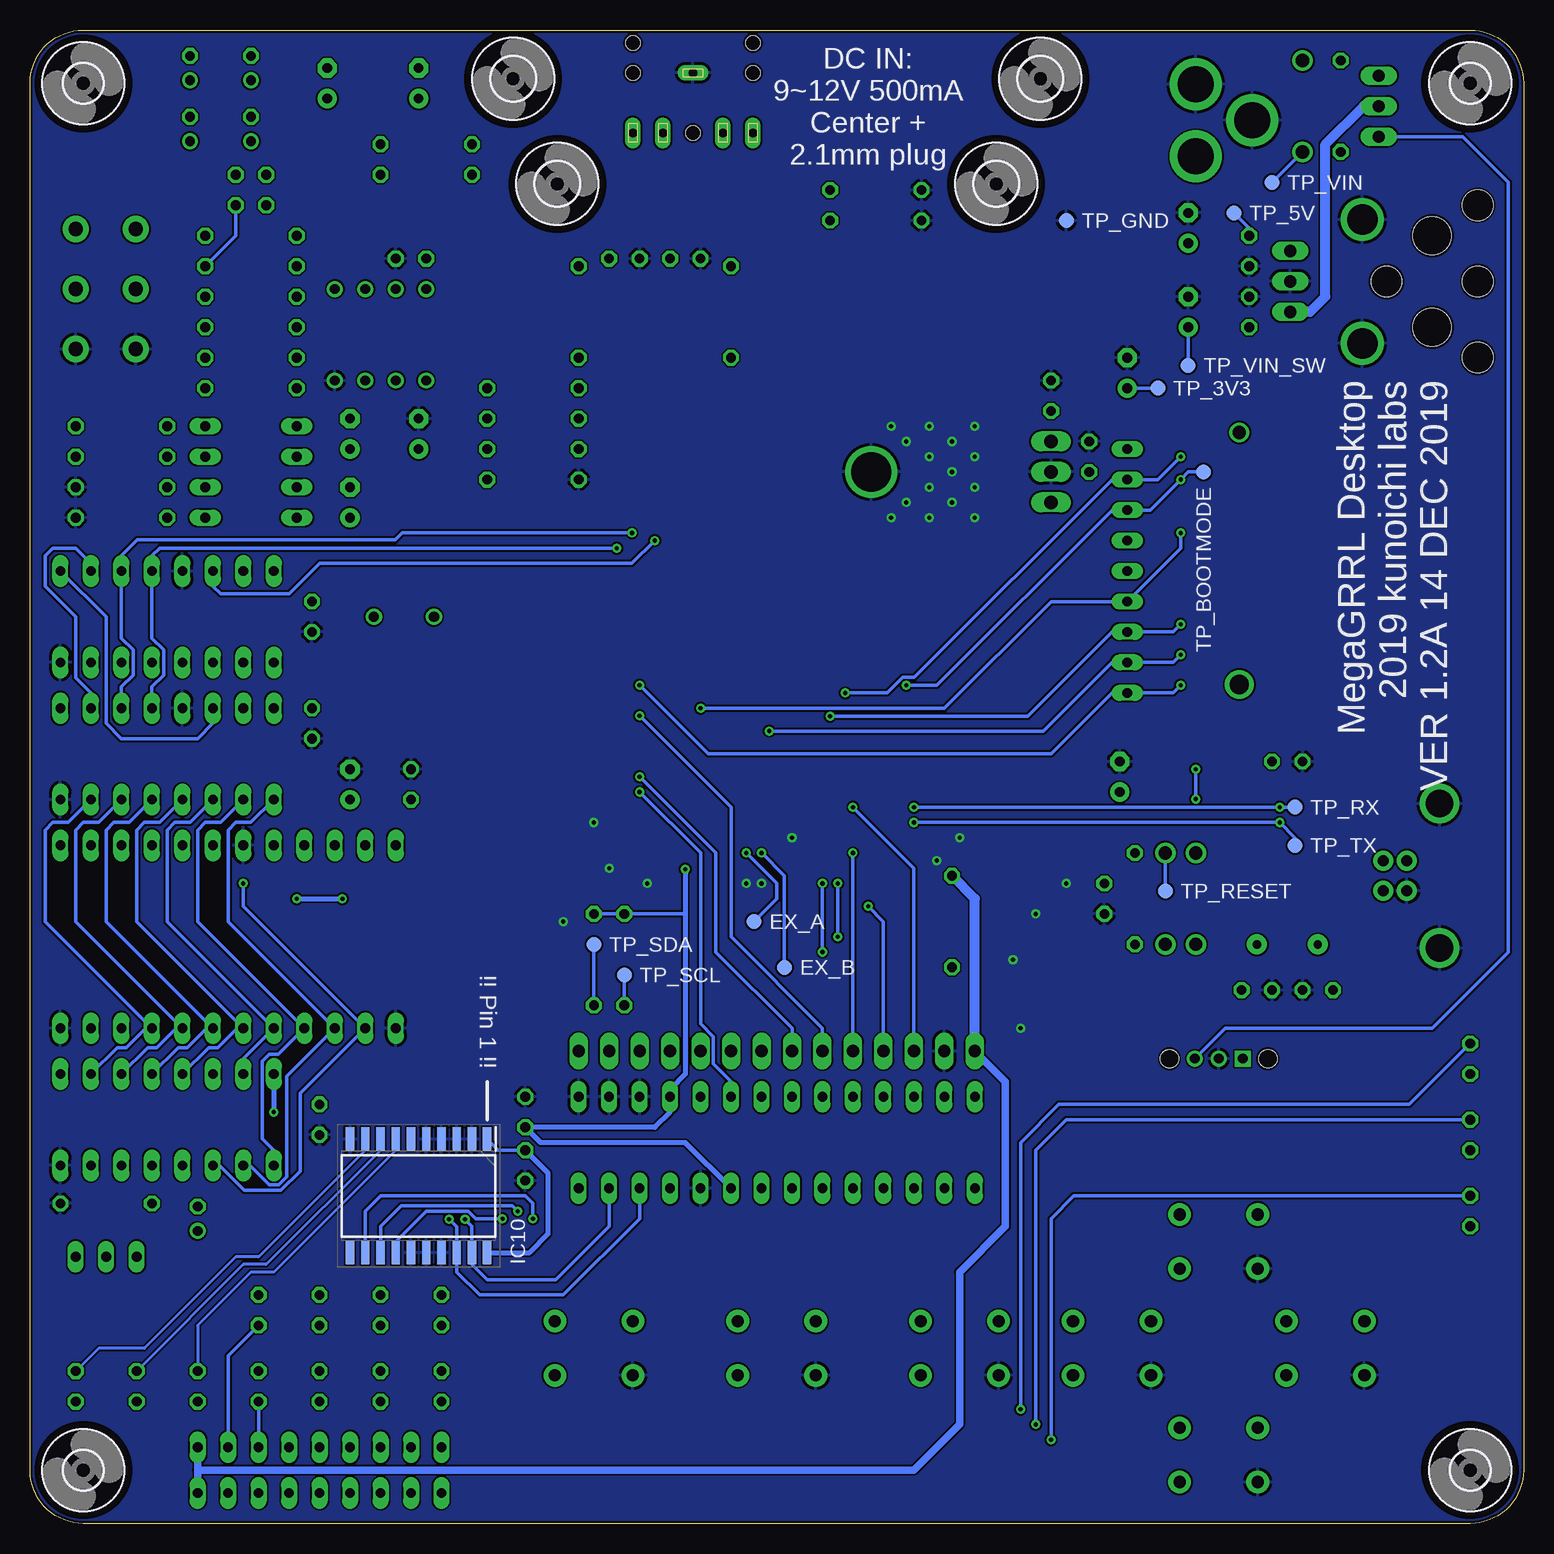
[diagram p8: board, bottom side, seen from below]

Size 124.46 x 124.46 mm. Coordinates in mm from the lower left corner, seen from the top.
Outline: 4.45,0 120.02,0 arc90 124.46,4.45 124.46,120.02 arc90 120.02,124.46 4.45,124.46 arc90 0,120.02 0,4.45 arc90 4.45,0
Copper layers (1*16): Top 0.035mm / dielectric 1.5mm / Bottom 0.035mm
Design rules "default *": minimum track width 6mil, minimum drill 0.35mm, track to track 6mil, track to pad 6mil, pad to pad 6mil, via to via 6mil, smd to smd 6mil, copper to edge 8mil, drill to drill 6mil, minimum pad ring 10mil, minimum via ring 8mil, stop-mask expansion 2mil, vias tented up to drill 100mil, thermal gap 10mil
Holes 2.54 mm at 3.81,109.86 3.81,97.16 3.81,103.5 11.43,103.5
Holes 3.17 mm at 7.62,107.31 7.62,99.69

### Footprints (pad centres in the part's own frame; a part is rotated, then mirrored left to right if it is on the bottom)
C025-024X044 = drill 0.813 octagon: 1 -1.27,0; 2 1.27,0
E2,5-5 = drill 0.813 pad 1.6: + -1.27,0 | drill 0.813 pad 1.6 octagon: - 1.27,0
E2-4 = drill 0.813 pad 1.27: + -1.016,0 | drill 0.813 pad 1.27 octagon: - 1.016,0
E2,5-7 = drill 0.813 pad 1.6: + -1.27,0 | drill 0.813 pad 1.6 octagon: - 1.27,0
DO41-7.6 = drill 1.1 pad 1.7: A 3.81,0; C -3.81,0
B1,27 = smd 1.27 x 1.27: TP 0,0
3,6 = hole 3.6: 0,0
3,2 = hole 3.2: 0,0
TO220H = drill 1.118 long: 1 -2.54,-10.16; 2 0,-10.16; 3 2.54,-10.16 | drill 3.302: TAB 0,4.826
DIL16 = drill 0.813 long: 1 -8.89,-3.81; 2 -6.35,-3.81; 3 -3.81,-3.81; 4 -1.27,-3.81; 5 1.27,-3.81; 6 3.81,-3.81; 7 6.35,-3.81; 8 8.89,-3.81; 9 8.89,3.81; 10 6.35,3.81; 11 3.81,3.81; 12 1.27,3.81; 13 -1.27,3.81; 14 -3.81,3.81; 15 -6.35,3.81; 16 -8.89,3.81
DIL28-3 = drill 0.813 long: 1 -16.51,-3.81; 2 -13.97,-3.81; 3 -11.43,-3.81; 4 -8.89,-3.81; 5 -6.35,-3.81; 6 -3.81,-3.81; 7 -1.27,-3.81; 8 1.27,-3.81; 9 3.81,-3.81; 10 6.35,-3.81; 11 8.89,-3.81; 12 11.43,-3.81; 13 13.97,-3.81; 14 16.51,-3.81; 15 16.51,3.81; 16 13.97,3.81; 17 11.43,3.81; 18 8.89,3.81; 19 6.35,3.81; 20 3.81,3.81; 21 1.27,3.81; 22 -1.27,3.81; 23 -3.81,3.81; 24 -6.35,3.81; 25 -8.89,3.81; 26 -11.43,3.81; 27 -13.97,3.81; 28 -16.51,3.81
DIL08 = drill 0.813 pad 1.27: 1 -3.81,-3.81; 2 -1.27,-3.81; 3 1.27,-3.81; 4 3.81,-3.81; 5 3.81,3.81; 6 1.27,3.81; 7 -1.27,3.81; 8 -3.81,3.81
TO220V = drill 1.016 long: 1 -2.54,-2.54; 2 0,-2.54; 3 2.54,-2.54
YM2612 = drill 0.813 long: /CS 11.43,7.62; /IC 11.43,-7.62; /IRQ 13.97,7.62; /RD 6.35,7.62; /WR 8.89,7.62; A0 3.81,7.62; A1 1.27,7.62; AGND -1.27,7.62; AVCC -8.89,7.62; D0 -11.43,-7.62; D1 -8.89,-7.62; D2 -6.35,-7.62; D3 -3.81,-7.62; D4 -1.27,-7.62; D5 1.27,-7.62; D6 3.81,-7.62; D7 6.35,-7.62; GND@1 -13.97,-7.62; GND@2 13.97,-7.62; M -13.97,7.62; MOL -6.35,7.62; MOR -3.81,7.62; NC 8.89,-7.62; VCC -11.43,7.62
SN76489 = drill 0.813 long: /OE 8.89,-3.81; /WE 6.35,-3.81; CLOCK 1.27,3.81; D0 11.43,3.81; D1 8.89,3.81; D2 6.35,3.81; D3 3.81,3.81; D4 -1.27,3.81; D5 -3.81,-3.81; D6 -1.27,-3.81; D7 1.27,-3.81; GND 13.97,-3.81; NC 13.97,3.81; READY 3.81,-3.81; SND_OUT 11.43,-3.81; VCC -3.81,3.81
SOIC127P1032X265-20N = smd 1.95 x 0.7: 1 -4.725,5.715; 2 -4.725,4.445; 3 -4.725,3.175; 4 -4.725,1.905; 5 -4.725,0.635; 6 -4.725,-0.635; 7 -4.725,-1.905; 8 -4.725,-3.175; 9 -4.725,-4.445; 10 -4.725,-5.715; 11 4.725,-5.715; 12 4.725,-4.445; 13 4.725,-3.175; 14 4.725,-1.905; 15 4.725,-0.635; 16 4.725,0.635; 17 4.725,1.905; 18 4.725,3.175; 19 4.725,4.445; 20 4.725,5.715
D8 = smd 1.981 x 0.559: 1 -2.464,1.905; 2 -2.464,0.635; 3 -2.464,-0.635; 4 -2.464,-1.905; 5 2.464,-1.905; 6 2.464,-0.635; 7 2.464,0.635; 8 2.464,1.905
ESP-WROOM-32-NO-RF = smd 0.9 x 1.5: 1 7.7,9; 2 6.43,9; 3 5.16,9; 4 3.89,9; 5 2.62,9; 6 1.35,9; 7 0.08,9; 8 -1.19,9; 9 -2.46,9; 10 -3.73,9; 11 -5,9; 12 -6.27,9; 13 -7.54,9; 14 -8.81,9; 25 -8.81,-9; 26 -7.54,-9; 27 -6.27,-9; 28 -5,-9; 29 -3.73,-9; 30 -2.46,-9; 31 -1.19,-9; 32 0.08,-9; 33 1.35,-9; 34 2.62,-9; 35 3.89,-9; 36 5.16,-9; 37 6.43,-9; 38 7.7,-9 | smd 1.5 x 0.9: 15 -10.3,5.715; 16 -10.3,4.445; 17 -10.3,3.175; 18 -10.3,1.905; 19 -10.3,0.635; 20 -10.3,-0.635; 21 -10.3,-1.905; 22 -10.3,-3.175; 23 -10.3,-4.445; 24 -10.3,-5.715 | smd 6 x 6: GND 0,0
SOIC16 = smd 0.635 x 1.524: 1 -4.445,-2.695; 2 -3.175,-2.695; 3 -1.905,-2.695; 4 -0.635,-2.695; 5 0.635,-2.695; 6 1.905,-2.695; 7 3.175,-2.695; 8 4.445,-2.695; 9 4.445,2.695; 10 3.175,2.695; 11 1.905,2.695; 12 0.635,2.695; 13 -0.635,2.695; 14 -1.905,2.695; 15 -3.175,2.695; 16 -4.445,2.695
USB-B-PTH = drill 0.914 pad 1.676: D+ 4,1.25; D- 5.981,1.25; GND 4,-1.25; VBUS 5.981,-1.25 | drill 2.286: SHLD1 1.282,-6.02; SHLD2 1.282,6.02
SWITCHCRAFT_35RAPC4BHN2 = drill 0.7 pad 1.3 long: 1 0,-1; 2 5,4; 3 -5,4; 10 2.5,4; 11 -2.5,4 | hole 1.2: 0,4; -5,-1; -5,-3.5; 5,-1; 5,-3.5
2041021-3_2 = smd 1 x 1.5: 1 20.175,0.45; 2 17.675,0.45; 3 15.175,0.45; 4 12.675,0.45; 5 10.175,0.45; 6 7.675,0.45; 7 5.245,0.45; 8 3.545,0.45; 9 22.675,0.45 | smd 0.7 x 1.5: 10 2.345,0.45; 11 1.145,0.45 | smd 1.5 x 2.8: 12 -0.35,-23.05; 13 26.95,-23.05; 14 -0.35,-1.55; 15 24.75,-1.55 | drill 1.1 pad 1.65: 16 1.8,-2.35 | drill 1.6 pad 2.2: 17 22.8,-2.35
POWER_JACK_PTH = drill 2.997 pad 4.318: GND 0,7.7; GNDBREAK 4.7,10.7; PWR 0,13.7
ILI9341_2_4 = drill 1.016 long: 1 -16.51,0; 2 -13.97,0; 3 -11.43,0; 4 -8.89,0; 5 -6.35,0; 6 -3.81,0; 7 -1.27,0; 8 1.27,0; 9 3.81,0; 10 6.35,0; 11 8.89,0; 12 11.43,0; 13 13.97,0; 14 16.51,0
581002B02500G-ISH = drill 2.54 pad 3.302: B -5.156,3.454; B1 5.156,3.454
RL622_SERIES = drill 0.864 pad 1.372: 1 -5.004,0; 2 0,0
LED3MM = drill 0.813 octagon: A -1.27,0; K 1.27,0
TO220BV = drill 1.016 long: D 0,-2.54; G -2.54,-2.54; S 2.54,-2.54
0204/7 = drill 0.813 octagon: 1 -3.81,0; 2 3.81,0
3RP/1610G = drill 1.2 pad 2.184: 1-1 -5,0; 1-2 0,0; 1-3 5,0; 2-1 -5,5; 2-2 0,5; 2-3 5,5
S64W = drill 0.813 long: A 2.54,1.27; E -2.54,1.27; S 0,1.27
SIL9 = drill 0.813 long: 1 -10.16,0; 2 -7.62,0; 3 -5.08,0; 4 -2.54,0; 5 0,0; 6 2.54,0; 7 5.08,0; 8 7.62,0; 9 10.16,0
DIP04S = drill 0.813 long: 1 -3.81,-3.81; 2 -1.27,-3.81; 3 1.27,-3.81; 4 3.81,-3.81; 5 3.81,3.81; 6 1.27,3.81; 7 -1.27,3.81; 8 -3.81,3.81
SW_OS102011MS2QN1 = drill 0.8 square: 1 -2,0 | drill 0.8: 2 0,0; 3 2,0 | hole 1.5: -4.1,0; 4.1,0
TACTILE_SWITCH_PTH_6.0MM = drill 1.016 pad 1.88: 1 -3.251,2.261; 2 3.251,2.261; 3 -3.251,-2.261; 4 3.251,-2.261
HC49US = drill 0.7 pad 1.651: 1 -2.54,0; 2 2.54,0

### Placement (x,y rotation side)
C1  100.97,75.56 270 top
C2  92.08,90.81 90 top
C3  106.05,112.39 180 top
C4  106.05,109.86 180 top
C5  92.71,105.41 0 top
C6  97.79,90.81 90 top
C7  97.79,85.09 90 top
C8  110.49,25.4 90 top
C9  34.92,52.07 270 top
C10  33.66,62.23 90 top
C11  100.33,33.66 270 top
C12  92.71,61.59 90 top
C13  97.79,61.59 90 top
C14  111.12,121.28 90 top
C15  111.12,116.2 90 top
C16  106.05,121.28 90 top
C17  106.05,116.2 90 top
C18  74.93,105.41 180 top
C19  69.85,105.41 180 top
C20  92.08,120.02 90 top
C21  99.69,120.02 90 top
C22  22.23,44.45 180 top
C23  17.14,44.45 0 top
C24  19.68,63.5 180 top
C25  100.97,66.67 270 top
C26  27.94,100.97 90 top
C28  27.94,107.95 90 top
C29  22.86,106.05 270 top
C30  22.86,100.97 90 top
C31  39.37,93.98 90 top
C32  36.2,88.9 90 top
C33  33.02,95.89 90 top
C34  83.19,34.29 90 top
C35  83.19,29.84 270 top
D1  27.3,52.07 90 top
D2  29.84,52.07 90 top
D3  18.41,118.11 90 top
EX_A  64.14,50.16 0 bottom
EX_B  61.59,46.35 0 bottom
H1  43.94,111.63 0 bottom
H2  80.52,111.63 0 bottom
H3  4.45,120.02 0 bottom
H4  4.45,4.45 0 bottom
H5  40.26,120.4 0 bottom
H6  84.2,120.4 0 bottom
H7  120.02,4.45 0 bottom
H8  120.02,120.02 0 bottom
IC1  49.53,87.63 270 top
IC2  113.03,64.14 0 top
IC3  113.03,75.56 0 top
IC4  62.23,31.75 0 top
IC5  95.25,99.06 0 top
IC6  16.89,103.5 90 top
IC7  107.95,48.9 0 top
IC8  107.95,33.66 0 top
IC9  92.08,27.3 90 top
IC10  92.08,27.3 270 bottom
IC11  72.39,100.97 0 top
IC12  62.23,60.96 270 top
IC14  19.68,57.15 270 top
J1  5.71,53.98 0 top
J2  69.22,119.89 180 top
J3  26.04,92.71 270 top
J4  27.3,127.64 180 top
JP1  62.23,39.37 0 top
KK1  16.89,103.5 90 top
L1  90.81,75.56 180 top
LED1  90.17,11.43 90 top
LED2  95.25,11.43 90 top
LED3  100.33,11.43 90 top
LED4  105.41,11.43 90 top
LED5  110.49,11.43 90 top
LED6  115.57,11.43 90 top
LED7  120.65,11.43 90 top
LED8  90.17,17.78 90 top
LED9  95.25,17.78 90 top
LED10  100.33,17.78 90 top
LED11  105.41,17.78 90 top
LED12  4.45,38.73 90 top
LED13  4.45,32.38 90 top
LED14  4.45,26.04 90 top
Q1  9.53,118.11 90 top
R1  77.47,46.99 90 top
R2  74.93,46.99 90 top
R3  106.05,107.31 0 top
R4  106.05,104.78 0 top
R5  106.05,97.16 180 top
R6  116.84,88.9 0 top
R7  106.05,94.61 180 top
R8  116.84,91.44 0 top
R9  106.05,102.23 180 top
R10  118.11,26.67 0 top
R11  106.05,99.69 180 top
R12  47.62,50.16 90 top
R13  32.38,52.07 90 top
R14  120.65,102.87 90 top
R15  78.74,100.97 90 top
R16  66.04,100.97 90 top
R17  82.55,94.61 180 top
R18  82.55,92.08 180 top
R19  91.44,114.94 180 top
R20  91.44,112.39 180 top
R21  116.84,86.36 180 top
R22  116.84,83.82 180 top
R23  118.11,20.95 0 top
R24  82.55,89.53 180 top
R25  82.55,87 0 top
R26  15.24,118.11 90 top
R27  53.98,111.12 0 top
R28  53.98,108.58 0 top
RN1  100.33,6.35 180 top
RN2  33.02,79.38 270 top
RN3  100.33,2.54 180 top
S1  106.05,87.63 90 top
S2  25.4,38.73 0 top
SWA  46.99,14.61 0 top
SWB  62.23,14.61 0 top
SWC  77.47,14.61 0 top
SWDOWN  25.4,5.71 0 top
SWLEFT  16.51,14.61 0 top
SWRIGHT  34.29,14.61 0 top
SWUP  25.4,23.5 0 top
TP_3V3  30.48,94.61 0 bottom
TP_5V  24.13,109.22 0 bottom
TP_BOOTMODE  26.67,87.63 0 bottom
TP_GND  38.1,108.58 0 bottom
TP_RESET  29.84,52.7 0 bottom
TP_RX  19.05,59.69 0 bottom
TP_SCL  74.93,45.72 0 bottom
TP_SDA  77.47,48.26 0 bottom
TP_TX  19.05,56.52 0 bottom
TP_VIN  20.95,111.76 0 bottom
TP_VIN_SW  27.94,96.52 0 bottom
Y1  19.68,48.26 180 top

### Tracks (layer width: path | path; a pad name or v marks a point on that pad's centre or on a via)
+3V3  (via drill 0.35)
  Top 0.305: IC14.16 20.95,63.02 C24.1 19.68,64.77 15.88,64.77 15.24,64.14 15.24,58.42 15.88,57.78 IC14.4 | R13.1 26.04,54.61 26.04,61.59 | J3.4 29.82,80.03 29.84,80.01 | IC10.1 86.36,33.66 87,34.29 89.53,34.29 90.17,33.66 IC9.17
  Top 0.406: IC14.16 26.04,61.59 | v69.85,54.53 IC12.2 | C34.1 C35.1 83.82,30.48 85.72,30.48 86.36,31.11 IC10.1
  Top 0.813: v69.85,54.53 62.78,54.53 59.69,51.44 v54.61,51.44 43.43,51.44 C10.+ 33.27,61.59 26.04,61.59 26.04,64.77 29.84,68.58 29.84,80.01 29.84,86.36 RN2.1 | C33.+ RN2.1 | IC1.3 38.73,85.09 C32.1 34.29,89.53 RN2.1
  Bottom 0.305: JP1.4 53.34,50.16 v54.61,51.44 | C35.1 85.44,31.11 IC10.1 | R1.2 R2.2 69.85,50.8 | TP_3V3.TP C33.+
  Bottom 0.406: v69.85,54.53 69.85,50.8 69.85,37.47 71.12,36.2 IC4.18 71.12,34.29 72.39,33.02 C34.1 81.92,31.75 69.85,31.75 IC4.9 | IC10.20 82.83,22.58 81.28,24.13 81.28,29.21 C35.1
+5V  (via drill 0.35)
  Top 0.305: IC3.10 119.38,78.11 118.11,76.83 104.14,76.83
  Top 0.406: IC2.16 104.14,66.67 105.41,65.41 105.41,52.07 | IC2.16 104.14,69.66 103.12,70.67 103.12,72.84 104.14,73.85 104.14,76.83 | 104.14,76.83 IC3.16 | IC2.16 C25.1 | IC7./RD 114.3,53.98 112.39,52.07 105.41,52.07 | 105.41,52.07 v102.23,52.07 | C1.1 104.14,76.83 | v98.42,52.07 96.52,53.98 IC7.VCC C12.1 90.81,62.23 L1.2
  Top 0.813: 41.91,95.25 41.91,59.69 R12.2 | 41.91,95.25 67.31,95.25 87,75.56 L1.2 | IC6.3 20.7,107.31 C29.1 27.3,107.31 C28.+ 30.48,106.68 41.91,95.25
  Bottom 0.305: IC3.10 119.38,80.01 120.65,81.28 122.56,81.28 123.19,80.64 123.19,78.11 120.65,75.56 120.65,70.48 119.38,69.22 IC2.10 | C29.1 22.86,107.95 TP_5V.TP
  Bottom 0.406: v102.23,52.07 v98.42,52.07
  Bottom 0.61: JP1.1 43.18,36.83 43.18,24.77 46.99,20.95 46.99,8.26 50.8,4.45 110.49,4.45 | RN1.1 110.49,4.45 | 110.49,4.45 RN3.1
  Bottom 0.813: R12.2 45.72,52.07 JP1.1
+5V/2  (via drill 0.35)
  Top 0.406: IC8.VCC 102.87,38.73 102.87,49.53 99.06,53.34 IC7.AVCC | IC11.8 76.2,102.87 C18.1 | v104.14,34.29 100.97,34.29 C11.1
  Top 0.61: C5.1 IC5.8 91.44,100.97 88.9,98.42 88.9,92.08 87.63,90.81 82.55,90.81 | IC7.AVCC 99.06,59.05 C13.+ 95.81,62.31 L1.1 82.55,88.82 82.55,89.53 | 76.2,102.87 80.01,102.87 82.55,100.33 82.55,90.81 | 82.55,89.53 82.55,90.81 | R24.2 82.55,89.53
  Bottom 0.406: IC8.VCC v104.14,34.29
+12V
  Top 0.813: IC1.1 C31.1 38.1,92.71 37.47,93.34 37.47,95.25 33.02,99.69 C26.+ C30.1 20.7,99.69 IC6.1
  Bottom 0.305: C26.+ TP_VIN_SW.TP
  Bottom 0.813: IC6.1 17.78,100.97 16.51,102.23 16.51,114.94 13.34,118.11 Q1.D
/CS_FM
  Top 0.305: IC3.7 119.38,69.97 120.34,69 120.34,59.27 119.38,58.3 IC7./CS
/CS_PSG
  Top 0.305: IC3.6 116.84,69.97 118.26,68.55 118.26,32.54 116.84,31.11 IC8./OE
/IC
  Top 0.305: IC7./IC 119.38,54.49 120.8,55.91 120.8,72.87 119.38,74.3 113.03,74.3 111.76,73.03 IC3.4
/WR
  Top 0.305: IC8./WE 114.3,31.11 115.57,32.38 115.57,42.55 116.84,43.81 IC7./WR 116.84,58.3 117.81,59.27 117.81,61.9 115.57,64.14 115.57,69.22 114.3,70.48 IC3.5
A0
  Top 0.305: IC3.3 110.8,70.18 110.8,63.32 112.72,61.38 112.72,59.27 111.76,58.3 IC7.A0
A1
  Top 0.305: IC3.2 108.25,70.18 108.25,63.32 110.19,61.38 110.19,59.27 109.22,58.3 IC7.A1
AUDIO_FML
  Top 0.305: IC7.MOL 101.6,59.04 99.06,61.58 99.06,66.03 98.6,66.49 98.6,77.47 96.52,79.55 96.52,88.27 C6.+ 98.42,88.9 S1.6
AUDIO_FMR
  Top 0.305: IC7.MOR 104.14,57.15 99.69,61.59 99.69,66.04 99.06,66.67 99.06,82.8 C7.+ S1.8
AUDIO_LINEL
  Top 0.305: C16.+ 95,109.22 90.17,109.22 86.36,105.41 R17.1
AUDIO_LINER
  Top 0.305: C17.+ 102.49,115.19 95.89,108.58 90.81,108.58 87,104.78 87,95.34 87.33,95.02 87.33,93.04 R18.1
AUDIO_PSG
  Top 0.305: IC8.SND_OUT 119.38,28.57 117.47,26.67 R10.1 110.74,26.67 C8.-
AUDIO_RAWL
  Top 0.305: R3.2 109.86,106.14 110.82,105.17 110.82,103.92 109.86,102.95 R9.1 114,98.09 114,91.04 113.03,90.08 R6.1 | R3.2 106.2,103.66 100.28,103.66 99.65,104.29 96.58,104.29 95.56,103.27 95.56,98.09 93.98,96.52 IC5.2 | R3.2 109.86,109.86 C3.1
AUDIO_RAWR
  Top 0.305: IC5.6 97.48,103.83 99.46,103.83 100.09,103.2 108.28,103.2 R4.2 109.86,103.6 108.89,102.64 108.89,101.38 109.86,100.41 R11.1 113.03,96.52 R8.1
  Bottom 0.305: C4.1 107.31,107.31 R4.2
CLK_FM
  Top 0.305: IC12.29 51.52,64.69 50.16,66.04 50.16,72.39 51.44,73.66 76.83,73.66 IC7.M
CLK_PSG
  Top 0.305: IC12.9 80.72,63.42 100.33,43.81 100.33,36.83 101.6,35.56 108.58,35.56 109.22,36.2 IC8.CLOCK
D0  (via drill 0.35)
  Top 0.305: IC2.15 106.68,62.87 107.95,61.59 107.95,54.61 v106.68,53.34
  Bottom 0.305: IC8.D7 108.7,29.84 106.62,27.76 103.55,27.76 101.96,29.36 101.96,35.84 IC7.D0 106.68,51.44 v106.68,53.34
D1
  Bottom 0.305: IC8.D6 106.17,29.84 104.54,28.22 103.74,28.22 103.05,28.91 103.05,37.29 IC7.D1 107.95,50.16 107.95,57.78 107.31,58.42 106.05,58.42 IC2.1
D2
  Bottom 0.305: IC8.D5 104.14,31.11 105.11,32.08 105.11,38.52 104.54,39.09 103.78,39.09 IC7.D2 110.49,50.16 110.49,57.78 109.86,58.42 108.58,58.42 IC2.2
D3
  Bottom 0.305: IC8.D4 106.68,38.73 IC7.D3 113.03,50.16 113.03,57.78 112.39,58.42 111.12,58.42 IC2.3
D4
  Bottom 0.305: IC8.D3 109.58,39.65 108.82,39.65 107.19,41.27 IC7.D4 115.57,50.16 115.57,57.78 114.94,58.42 113.67,58.42 IC2.4
D5
  Bottom 0.305: IC8.D2 112.12,39.65 111.36,39.65 109.73,41.27 IC7.D5 118.11,50.16 118.11,57.78 117.47,58.42 116.2,58.42 IC2.5
D6
  Bottom 0.305: IC8.D1 114.66,39.65 113.9,39.65 112.28,41.27 IC7.D6 120.65,50.16 120.65,57.78 120.02,58.42 118.75,58.42 IC2.6
D7
  Bottom 0.305: IC8.D0 117.2,39.65 116.44,39.65 114.81,41.27 IC7.D7 123.19,50.16 123.19,57.78 122.56,58.42 121.28,58.42 IC2.7
ESP32_RESET
  Top 0.305: D2.A R13.2 C9.1 39.06,49.2 48.66,49.2 50.18,50.72 59.98,50.72 61.33,52.07 73.66,52.07 74.3,52.7 74.3,55.24 73.66,55.88 71.31,55.88 IC12.3
  Bottom 0.305: TP_RESET.TP D2.A
FM1
  Top 0.254: IC9.14 93.98,25.4 93.34,24.77 93.34,15.88 LED1.K
FM1N
  Top 0.305: LED1.A 92.71,7.62 RN1.8
FM2
  Top 0.254: IC9.7 93.98,13.97 LED2.K
FM2N
  Top 0.305: LED2.A RN1.7
FM3
  Top 0.254: IC9.8 95.25,20.95 97.79,18.41 97.79,15.24 LED3.K
FM3N
  Top 0.305: LED3.A RN1.5
FM4
  Top 0.254: IC9.9 96.52,21.59 97.79,20.32 101.6,20.32 102.87,19.05 102.87,15.24 LED4.K
FM4N
  Bottom 0.305: LED4.A RN1.3
FM5
  Bottom 0.254: IC10.7 93.98,31.11 104.14,20.95 106.05,20.95 110.49,16.51 LED5.K
FM5N
  Top 0.305: LED5.A 109.22,8.89 105.41,8.89 104.14,7.62 104.14,3.81 RN3.4
FM6
  Bottom 0.254: IC10.8 95.25,31.11 104.78,21.59 106.68,21.59 LED6.K
FM6N
  Top 0.305: LED6.A 113.67,8.26 107.31,8.26 106.68,7.62 106.68,3.81 RN3.3
FMS
  Bottom 0.254: IC10.9 96.52,31.11 105.41,22.23 107.31,22.23 114.94,14.61 118.75,14.61 LED7.K
FMSN
  Top 0.305: LED7.A 119.38,8.89 116.2,8.89 111.76,4.45 109.22,4.45 107.95,3.17 RN3.2
GND  (via drill 0.35)
  other vias: 60.96,57.15 63.5,53.34 64.77,53.34 73.03,53.34 46.99,57.15 48.9,55.24 38.1,53.34 40.64,50.8 42.55,46.99 41.91,41.27 76.2,54.61 80.01,50.16 45.72,91.44 49.53,91.44 52.7,91.44 47.62,90.17 51.44,90.17 45.72,88.9 49.53,88.9 47.62,87.63 45.72,86.36 49.53,86.36 45.72,83.82 49.53,83.82 52.7,83.82 47.62,85.09 51.44,85.09 77.47,58.42
  pour Top: 125.09,-0.64 -0.64,-0.64 -0.64,125.09 125.09,125.09
  pour Bottom: 125.09,-0.64 -0.64,-0.64 -0.64,125.09 125.09,125.09
KEY_A
  Top 0.305: IC4.23 58.42,33.66 54.61,29.84 54.61,26.04 45.44,16.87 SWA.1
KEY_B
  Top 0.305: IC4.22 60.96,31.11 59.69,29.84 59.69,17.58 SWB.1
KEY_C
  Top 0.305: SWC.1 64.77,26.31 64.77,29.84 63.5,31.11 IC4.21
KEY_DOWN
  Top 0.305: IC4.25 48.9,31.11 42.55,31.11 22.15,10.72 SWDOWN.1
KEY_INT  (via drill 0.35)
  Top 0.305: IC12.7 71.31,60.96 v73.66,60.96
  Bottom 0.305: IC4.20 66.04,36.83 67.51,38.3 67.51,40.57 68.58,41.64 68.58,55.88 v73.66,60.96
KEY_LEFT
  Top 0.305: IC4.26 47.62,32.38 30.48,32.38 25.4,27.3 25.4,25.4 23.5,23.5 19.89,23.5 SWLEFT.1
KEY_RIGHT
  Top 0.305: IC4.24 50.16,29.84 43.18,29.84 31.04,17.7 SWRIGHT.1
KEY_UP
  Top 0.305: IC4.27 47.74,35.56 46.12,33.93 30.33,33.93 SWUP.1
LCD_/CS  (via drill 0.35)
  Top 0.305: IC12.33 53.31,59.69 v55.88,59.69
  Bottom 0.305: JP1.3 50.8,54.61 v55.88,59.69
LCD_CLK  (via drill 0.35)
  Top 0.305: IC12.8 71.31,62.23 v73.66,62.23
  Bottom 0.305: JP1.7 60.96,41.27 67.31,47.62 67.31,55.88 v73.66,62.23
LCD_DC  (via drill 0.35)
  Top 0.305: IC12.36 53.31,55.88 v55.88,55.88
  Bottom 0.305: v55.88,55.88 JP1.5
LCD_MOSI  (via drill 0.35)
  Top 0.305: IC12.12 71.31,67.31 v73.66,67.31
  Bottom 0.305: JP1.6 58.42,41.27 66.04,48.9 66.04,59.69 v73.66,67.31
N$1
  Top 0.305: C23.1 15.88,46.99 Y1.2 17.14,52.55 IC14.8
N$2
  Top 0.305: C22.1 23.5,46.99 Y1.1 22.23,49.53 17.78,53.98 IC14.7
N$3
  Top 0.305: S1.2 109.86,86.88 108.23,88.5 108.23,91.84 109.86,93.47 R7.1 107.31,94.61 R11.2
N$4
  Bottom 0.305: IC2.14 109.22,66.67 110.49,65.41 116.84,65.41 118.11,66.67 118.11,75.56 IC3.9
N$5
  Top 0.305: C14.+ 111.12,118.75 C3.2 102.23,109.86 R3.1 100.15,105.23 95.7,105.23 94.3,103.83 93.58,103.83 93.02,103.27 93.02,98.09 91.44,96.52 IC5.1
N$6
  Top 0.406: JP1.8 63.5,41.27 58.42,46.35 R12.1
N$7
  Top 0.305: C15.+ 108.74,115.19 106.35,112.8 106.35,111.43 C4.2 104.78,107.31 R4.1 95.89,104.78 IC5.7
N$8
  Top 0.305: C14.- 111.12,121.63 112.09,120.67 112.09,117.14 120.65,108.58 R14.1-3
N$9
  Top 0.305: R23.S 120.02,24.13 121.92,24.13 123.29,25.5 123.29,86.26 R6.2 R8.2
N$10
  Top 0.305: R7.2 102.23,93.47 103.86,91.84 103.86,88.5 102.23,86.88 S1.7 C7.-
N$11
  Top 0.305: R5.2 102.23,95.98 101.27,95.02 101.27,93.78 102.23,92.82 S1.5 98.42,91.44 C6.-
N$12
  Top 0.305: C15.- 115.65,112.7 R14.2-3
N$13
  Top 0.305: R14.1-2 120.65,105.25 122.5,107.1 122.5,109.27 113,118.77 113,122.43 111.71,123.72 110.54,123.72 109.11,122.3 C16.-
N$14
  Top 0.305: R14.2-2 119.25,106.47 121.23,106.47 122.05,107.29 122.05,108.45 117.47,113.02 117.47,113.03 112.55,117.96 112.55,122.24 111.53,123.27 110.72,123.27 110.16,122.7 110.16,121.34 C17.-
N$15
  Top 0.305: IC11.2 67.31,101.6 66.04,100.33 R16.1 72.39,97.16 74.93,94.61 R17.2
N$16
  Top 0.305: IC11.6 75.56,100.33 R15.1 81.28,94.61 81.28,93.34 80.01,92.08 R18.2
N$17
  Top 0.406: IC11.1 67.94,102.87 R16.2 66.51,104.78 69.61,107.87 76.43,107.87 77.62,106.68 83.82,106.68 90.17,113.03 90.17,116.84 C20.+
N$18
  Top 0.406: IC11.7 73.66,101.6 72.39,102.87 72.39,106.05 73.66,107.31 76.2,107.31 R15.2 80.01,106.05 83.97,106.05 90.73,112.8 90.73,114.86 94.61,118.75 C21.+
N$19
  Top 0.305: IC11.3 71.12,100.33 71.75,100.97 71.75,104.78 C19.1
N$20
  Top 0.406: R19.2 86.67,115.9 82.29,115.9 80.01,118.18 66.93,118.18 64.64,115.89 J2.2 59.45,111.12 R27.2
N$21
  Top 0.406: C20.- 93.46,119.9 100.17,119.9 100.85,119.22 100.85,118.27 100.17,117.59 97.9,117.59 R19.1
N$22
  Top 0.406: C21.- 99.69,121.17 101.41,119.45 101.41,118.03 100.41,117.03 99.89,117.03 R20.1
N$23
  Top 0.406: R20.2 82.6,107.37 78.69,107.37 77.47,108.58 74.3,108.58 | 74.3,108.58 R28.2 | J2.3 74.22,108.67 74.3,108.58
N$24
  Top 0.305: S1.4 109.86,92.82 110.82,93.78 110.82,95.02 109.86,95.98 R5.1 107.31,97.16 R9.2
N$25
  Top 0.305: S1.3 110.49,88.9 R21.2
N$26
  Top 0.305: S1.1 R22.2
N$27
  Top 0.305: C8.+ 113.41,24.38 R23.E
N$28
  Top 0.305: D1.C 24.77,50.8 24.77,56.52 23.5,57.78 IC14.13
N$29
  Top 0.305: D2.C 25.4,52.7 25.4,57.78 24.13,59.05 IC14.14
N$30
  Top 0.813: Q1.S 13.34,121.92 R26.2 15.24,117.47 D3.C
  Bottom 0.305: TP_VIN.TP D3.C
N$31
  Top 0.305: Q1.G 13.97,115.57 R26.1
  Bottom 0.305: S2.3 24.86,41.27 7.62,41.27 1.27,47.62 1.27,111.76 5.08,115.57 Q1.G
N$32
  Top 0.813: J4.PWR 21.32,113.94 18.41,116.84 D3.A
N$33  (via drill 0.35)
  Top 0.305: IC12.10 70.41,64.69 69.85,64.14 69.85,57.78 67.94,55.88 v64.77,55.88
  Bottom 0.305: EX_A.TP 62.23,52.07 62.23,53.34 v64.77,55.88
N$34  (via drill 0.35)
  Top 0.305: IC12.11 70.41,65.96 69.22,64.77 69.22,58.42 67.94,57.15 64.77,57.15 v63.5,55.88
  Bottom 0.305: v63.5,55.88 61.59,53.98 EX_B.TP
PSG1
  Top 0.254: IC9.6 92.71,21.59 LED8.K
PSG1N
  Top 0.305: LED8.A 90.17,14.06 89.2,13.1 89.2,9.76 90.17,8.79 RN1.9
PSG2
  Top 0.254: IC9.13 95.25,25.4 94.61,24.77 94.61,19.68 LED9.K
PSG2N
  Top 0.305: LED9.A 97.79,13.97 RN1.6
PSG3
  Top 0.254: IC9.12 96.52,24.77 95.89,24.13 95.89,21.5 98.33,19.05 LED10.K
PSG3N
  Top 0.305: LED10.A 102.87,13.97 RN1.4
PSGS
  Top 0.254: IC9.11 97.79,24.77 103.5,19.05 LED11.K
PSGSN
  Bottom 0.305: LED11.A 107.95,13.97 RN1.2
RXD  (via drill 0.35)
  Top 0.305: IC12.34 52.15,58.34 v50.8,59.69 | v20.32,59.69 18.41,59.69 17.78,60.33 IC14.2
  Bottom 0.305: v50.8,59.69 v20.32,59.69 TP_RX.TP
SCL  (via drill 0.35)
  Top 0.305: IC12.27 55.33,67.23 58.42,64.14 v58.42,53.34 | IC4.12 73.66,29.21 74.93,30.48 R2.1 71.12,43.18 66.67,47.62 v58.42,47.62 | IC9.18 88.9,29.84 89.53,29.21 v89.53,25.35
  Bottom 0.305: v58.42,53.34 v58.42,47.62 | v89.53,25.35 88.9,24.72 IC10.18 88.9,20.95 87,19.05 80.01,19.05 73.66,25.4 IC4.12 | R2.1 TP_SCL.TP
SD_CLK  (via drill 0.35)
  Top 0.305: J3.5 28.56,82.53 v28.57,82.55 | IC12.13 69.14,68.5 v68.58,67.94
  Bottom 0.305: v68.58,67.94 48.26,67.94 39.37,76.83 RN2.6 28.57,81.28 v28.57,82.55
SD_CMD  (via drill 0.35)
  Top 0.305: J3.2 28.47,75.03 v28.57,74.93 | IC12.23 v57.78,67.26
  Bottom 0.305: v57.78,67.26 41.32,67.26 34.29,74.3 RN2.7 29.21,74.3 v28.57,74.93
SD_D0  (via drill 0.35)
  Top 0.305: IC12.24 55.1,69.85 53.31,69.85 IC12.25 53.15,69.85 v51.44,69.85 | J3.7 28.11,87.47 v28.57,87 | D1.A v27.3,60.37 | v27.3,62.87 31.11,66.67 31.11,83.82 31.75,84.45 RN2.3
  Bottom 0.305: v51.44,69.85 48.9,69.85 34.29,84.45 RN2.3 31.11,84.45 v28.57,87 27.94,87.63 TP_BOOTMODE.TP | v27.3,60.37 v27.3,62.87
SD_D1  (via drill 0.35)
  Top 0.305: J3.8 28.31,89.17 v28.57,88.9 | IC12.26 55.8,68.5 v56.52,69.22
  Bottom 0.305: v28.57,88.9 30.48,87 RN2.2 34.29,87 50.75,70.53 51.72,70.53 53.04,69.22 v56.52,69.22
SD_D2  (via drill 0.35)
  Top 0.305: J3.9 28.39,70.03 v28.57,69.85 | IC12.14 71.31,69.85 v73.66,69.85
  Bottom 0.305: v28.57,69.85 29.21,69.22 RN2.9 34.29,69.22 39.37,64.14 67.94,64.14 v73.66,69.85
SD_D3  (via drill 0.35)
  Top 0.305: J3.1 28.43,72.53 v28.57,72.39 | IC12.16 66.67,69.85 v62.87,66.04
  Bottom 0.305: v28.57,72.39 29.21,71.75 RN2.8 34.29,71.75 40.01,66.04 v62.87,66.04
SDA  (via drill 0.35)
  Top 0.305: IC12.28 54.69,65.96 57.15,63.5 v57.15,53.34 | IC4.13 76.2,29.21 77.47,30.48 R1.1 77.47,43.81 75.56,45.72 70.48,45.72 67.31,48.9 v57.15,48.9 | v88.21,25.34 88.21,29.27 87.63,29.84 IC9.19
  Bottom 0.305: v57.15,53.34 v57.15,48.9 | v88.21,25.34 87.63,24.77 IC10.19 87.63,21.59 86.36,20.32 80.64,20.32 76.2,24.77 IC4.13 | R1.1 TP_SDA.TP
SHCLK  (via drill 0.35)
  Top 0.305: IC12.31 48.98,62.15 46.35,64.77 46.35,76.2 48.26,78.11 71.12,78.11 74.3,81.28 v74.3,82.55
  Bottom 0.305: IC2.11 116.84,69.73 115.88,70.69 115.88,72.81 116.84,73.78 IC3.11 116.84,80.64 115.52,81.96 94.03,81.96 93.44,82.55 v74.3,82.55
SHDATA  (via drill 0.35)
  Top 0.305: IC12.37 52.15,54.53 44.45,62.23 44.45,77.47 46.35,79.38 69.85,79.38 v72.39,81.92
  Bottom 0.305: IC3.14 109.22,78.11 108.58,77.47 102.87,77.47 100.33,80.01 74.3,80.01 v72.39,81.92
SHSTO  (via drill 0.35)
  Top 0.305: IC12.30 50.24,63.42 48.26,65.41 48.26,74.93 50.16,76.83 72.39,76.83 75.56,80.01 v75.56,81.28
  Bottom 0.305: IC2.12 114.3,69.73 113.33,70.69 113.33,72.81 114.3,73.78 IC3.12 114.3,80.64 113.67,81.28 v75.56,81.28
TXD  (via drill 0.35)
  Top 0.305: IC12.35 52.15,57.07 v50.8,58.42 | IC14.3 17.78,59.05 18.41,58.42 v20.32,58.42
  Bottom 0.305: v50.8,58.42 v20.32,58.42 19.05,57.15 TP_TX.TP
USB_N
  Top 0.305: J1.D- 16.97,55.23 IC14.6
USB_P
  Top 0.305: J1.D+ 11.26,56.52 IC14.5
USERA  (via drill 0.35)
  Top 0.305: v41.91,9.53 80.64,9.53 82.55,11.43 v82.55,25.4
  Bottom 0.305: v41.91,9.53 41.91,31.75 38.73,34.92 9.53,34.92 LED12.K | IC10.12 96.52,26.04 95.25,27.3 83.19,27.3 82.55,26.67 v82.55,25.4
USERAN
  Top 0.305: RN3.8 90.81,4.45 33.02,4.45 31.11,6.35 13.97,6.35 10.79,9.53 10.79,31.11 LED12.A
USERB  (via drill 0.35)
  Top 0.305: v40.64,8.26 81.28,8.26 83.82,10.79 v83.82,26.04
  Bottom 0.305: v40.64,8.26 40.64,31.11 38.1,33.66 LED13.K | IC10.13 95.25,24.77 93.52,26.49 84.28,26.49 v83.82,26.04
USERBN
  Top 0.305: RN3.9 88.9,2.54 88.27,3.17 32.38,3.17 30.48,5.08 13.34,5.08 9.53,8.89 9.53,26.04 LED13.A
USERC  (via drill 0.35)
  Top 0.305: v39.37,6.99 81.92,6.99 85.09,10.16 v85.09,25.4
  Bottom 0.305: v39.37,6.99 39.37,25.4 37.47,27.3 LED14.K | IC10.14 93.98,23.5 91.44,26.04 87.93,26.04 87.3,25.4 v85.09,25.4
USERCN
  Top 0.305: RN3.7 93.34,0.64 88.9,0.64 87.63,1.91 14.61,1.91 8.26,8.26 8.26,20.95 LED14.A
VBIAS
  Top 0.305: IC5.5 99.06,97.79 IC5.3 96.52,93.98 C2.+ R24.1 R25.2

### Text on the board
tNames: 9~12VDC 500mA | HOT !! | Volume | JLCJLCJLCJLC | Do not populate RN2 / until efuses have / been burned !! / / Populate card slot / before USB connector / or heatsink !! | HOT !! | IC14 | DIP SW.: OFF=YM3438, ON=YM2612 | On | PSG Mix
bNames: DC IN: / 9~12V 500mA / Center + / 2.1mm plug | MegaGRRL Desktop / 2019 kunoichi labs / VER 1.2A 14 DEC 2019 | !! Pin 1 !!